# Altium project LaserSchematic.PrjPcb
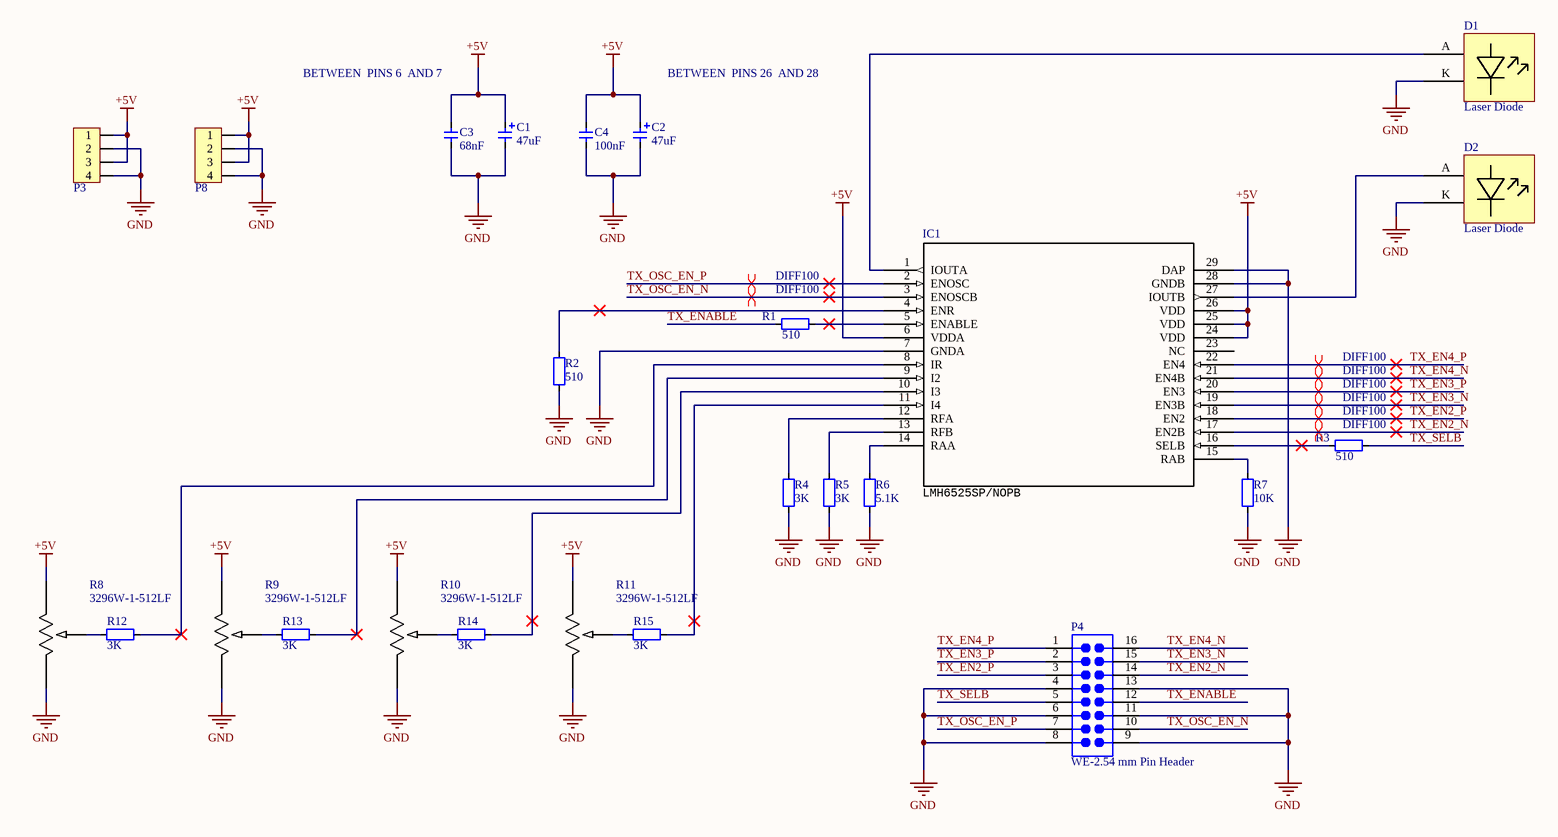
[diagram p0: TransmitterV1.SchDoc]
5 sheets, 290 parts. Net scope: global (net labels, ports and power ports of the same name join across sheets).
Board file: PCB.PcbDoc
Sheets:
  TransmitterV1.SchDoc
  PhotodiodeReceiverV1.SchDoc
  PowerSupply.SchDoc
  Main.SchDoc
  LVDSDriverReceiver.SchDoc

## Sheet TransmitterV1.SchDoc
size B

### Parts
C1  value 47uF  [CAP_TAN_B1210]  (hidden comment: Cap_Tan_1210)
C2  value 47uF  [CAP_TAN_B1210]  (hidden comment: Cap_Tan_1210)
C3  value 68nF  [CAP_0603]  (hidden comment: Cap_0603)
C4  value 100nF  [CAP_0603]  (hidden comment: Cap_0603)
D1  Laser Diode  [LaserDiode]
D2  Laser Diode  [LaserDiode]
IC1  Manufacturer_Part_Number: LMH6525SP/NOPB  [SPA28A]  (hidden comment: LMH6525SPNOPB)
P3  HDR1x4_2.54  [HDR1x4_2.54_180]  (value not drawn)
P4  WE-2.54 mm Pin Header  [61301621121]
P8  HDR1x4_2.54  [HDR1x4_2.54_180]  (value not drawn)
R1  value 510  [RES_0603]  (hidden comment: Res_0603)
R2  value 510  [RES_0603]  (hidden comment: Res_0603)
R3  value 510  [RES_0603]  (hidden comment: Res_0603)
R4  value 3K  [RES_0603]  (hidden comment: Res_0603)
R5  value 3K  [RES_0603]  (hidden comment: Res_0603)
R6  value 5.1K  [RES_0603]  (hidden comment: Res_0603)
R7  value 10K  [RES_0603]  (hidden comment: Res_0603)
R8  3296W-1-512LF  [POT_3296W]
R9  3296W-1-512LF  [POT_3296W]
R10  3296W-1-512LF  [POT_3296W]
R11  3296W-1-512LF  [POT_3296W]
R12  value 3K  [RES_0603]  (hidden comment: Res_0603)
R13  value 3K  [RES_0603]  (hidden comment: Res_0603)
R14  value 3K  [RES_0603]  (hidden comment: Res_0603)
R15  value 3K  [RES_0603]  (hidden comment: Res_0603)

### Nets
+5V: C1.1 C2.1 C3.2 C4.2 IC1.6(VDDA) IC1.24(VDD) IC1.25(VDD) IC1.26(VDD) P3.1 P3.3 P8.1 P8.3 R8.3 R9.3 R10.3 R11.3
GND: C1.2 C2.2 C3.1 C4.1 D1.K D2.K IC1.7(GNDA) IC1.28(GNDB) IC1.29(DAP) P3.2 P3.4 P4.4 P4.6 P4.8 P4.9 P4.11 P4.13 P8.2 P8.4 R2.1 R4.1 R5.1 R6.1 R7.1 R8.1 R9.1 R10.1 R11.1
TX_EN2_N: IC1.17(EN2B) P4.14
TX_EN2_P: IC1.18(EN2) P4.3
TX_EN3_N: IC1.19(EN3B) P4.15
TX_EN3_P: IC1.20(EN3) P4.2
TX_EN4_N: IC1.21(EN4B) P4.16
TX_EN4_P: IC1.22(EN4) P4.1
TX_ENABLE: P4.12 R1.1
TX_OSC_EN_N: IC1.3(ENOSCB) P4.10
TX_OSC_EN_P: IC1.2(ENOSC) P4.7
TX_SELB: P4.5 R3.2
NetD1_A: D1.A IC1.1(IOUTA)
NetD2_A: D2.A IC1.27(IOUTB)
NetIC1_4: IC1.4(ENR) R2.2
NetIC1_5: IC1.5(ENABLE) R1.2
NetIC1_8: IC1.8(IR) R12.2
NetIC1_9: IC1.9(I2) R13.2
NetIC1_10: IC1.10(I3) R14.2
NetIC1_11: IC1.11(I4) R15.2
NetIC1_12: IC1.12(RFA) R4.2
NetIC1_13: IC1.13(RFB) R5.2
NetIC1_14: IC1.14(RAA) R6.2
NetIC1_15: IC1.15(RAB) R7.2
NetIC1_16: IC1.16(SELB) R3.1
NetR8_2: R8.2 R12.1
NetR9_2: R9.2 R13.1
NetR10_2: R10.2 R14.1
NetR11_2: R11.2 R15.1

Not connected (* = marked no-connect by the designer): IC1 23(NC)

### Layout directives
differential pair; net class DIFF100: TX_EN2_N, TX_EN2_P, TX_EN3_N, TX_EN3_P, TX_EN4_N, TX_EN4_P, TX_OSC_EN_N, TX_OSC_EN_P

### Notes on the sheet
- (near C3) BETWEEN  PINS 6  AND 7
- BETWEEN  PINS 26  AND 28

### Library data of the parts
C1 C2 = Cap_Tan_1210: Capacitor
C3 C4 = Cap_0603: Capacitor
IC1 = LMH6525SPNOPB: Imported; Vendor: National Semiconductor; 3D_Library_Name: National_9-26-2011; C: Copyright (C) 2015 Accelerated Designs. All rights reserved; Copyright: Copyright (C) 2015 Accelerated Designs. All rights reserved; RefDes: RefDes; Type: DEV; Value: Value
P3 P8 = HDR1x4_2.54T: Header
P4 = WE-2.54 mm Pin Header & Jumper 61301621121: WR-PHD 2.54 mm Dual Pin Header; Manufacturer: WЁ№rth Elektronik eiSos GmbH; ComponentLink1 Description: Manufacturer; ComponentLink2 Description: Datasheet; NoPins: 16; Created Date: 25 March 2013; partNo: 61301621121; ComponentLink1URL: http://www.we-online.com; ComponentLink2URL: http://katalog.we-online.de/em/datasheet/6130xx21121.pdf; Created by: Karrer Zheng
R1-R7 R12-R15 = Res_0603: Resistor
R8-R11 = 3296W-1-503LF: Imported; Vendor: Bourns Electronics; HEADER_SECTION: Passives; HEADER_GROUP: Resistors; R-S_Number: 5219805; Tolerance: 10%; Voltage: Unknown; C: Copyright (C) 2015 Accelerated Designs. All rights reserved; Manufacturer_Part_Number: 3296W-1-503LF; Manufacturer_Name: Bourns Electronics; Mounting: Through Hole; Value: Value; Package/Case: Unknown; Current Rating: Unknown; Copyright: Copyright (C) 2015 Accelerated Designs. All rights reserved; RefDes: RefDes; Type: DEV

## Sheet PhotodiodeReceiverV1.SchDoc
size C; PageSetup: Record=PageOptions|CenterHorizontal=True|CenterVertical=True|PrintScale=1.06|XCorrection=1.00|YCorrection=1.00|PrintKind=1|BorderSize=5000000|LeftOffset=0|BottomOffset=0|Orientation=2|PaperLength=1000|PaperWidth=1000|Scale=100|PaperSource=7|PrintQuality=-3|MediaType=1|DitherType=10|PrintScaleMode=1|PaperKind=A3|PaperIndex=8
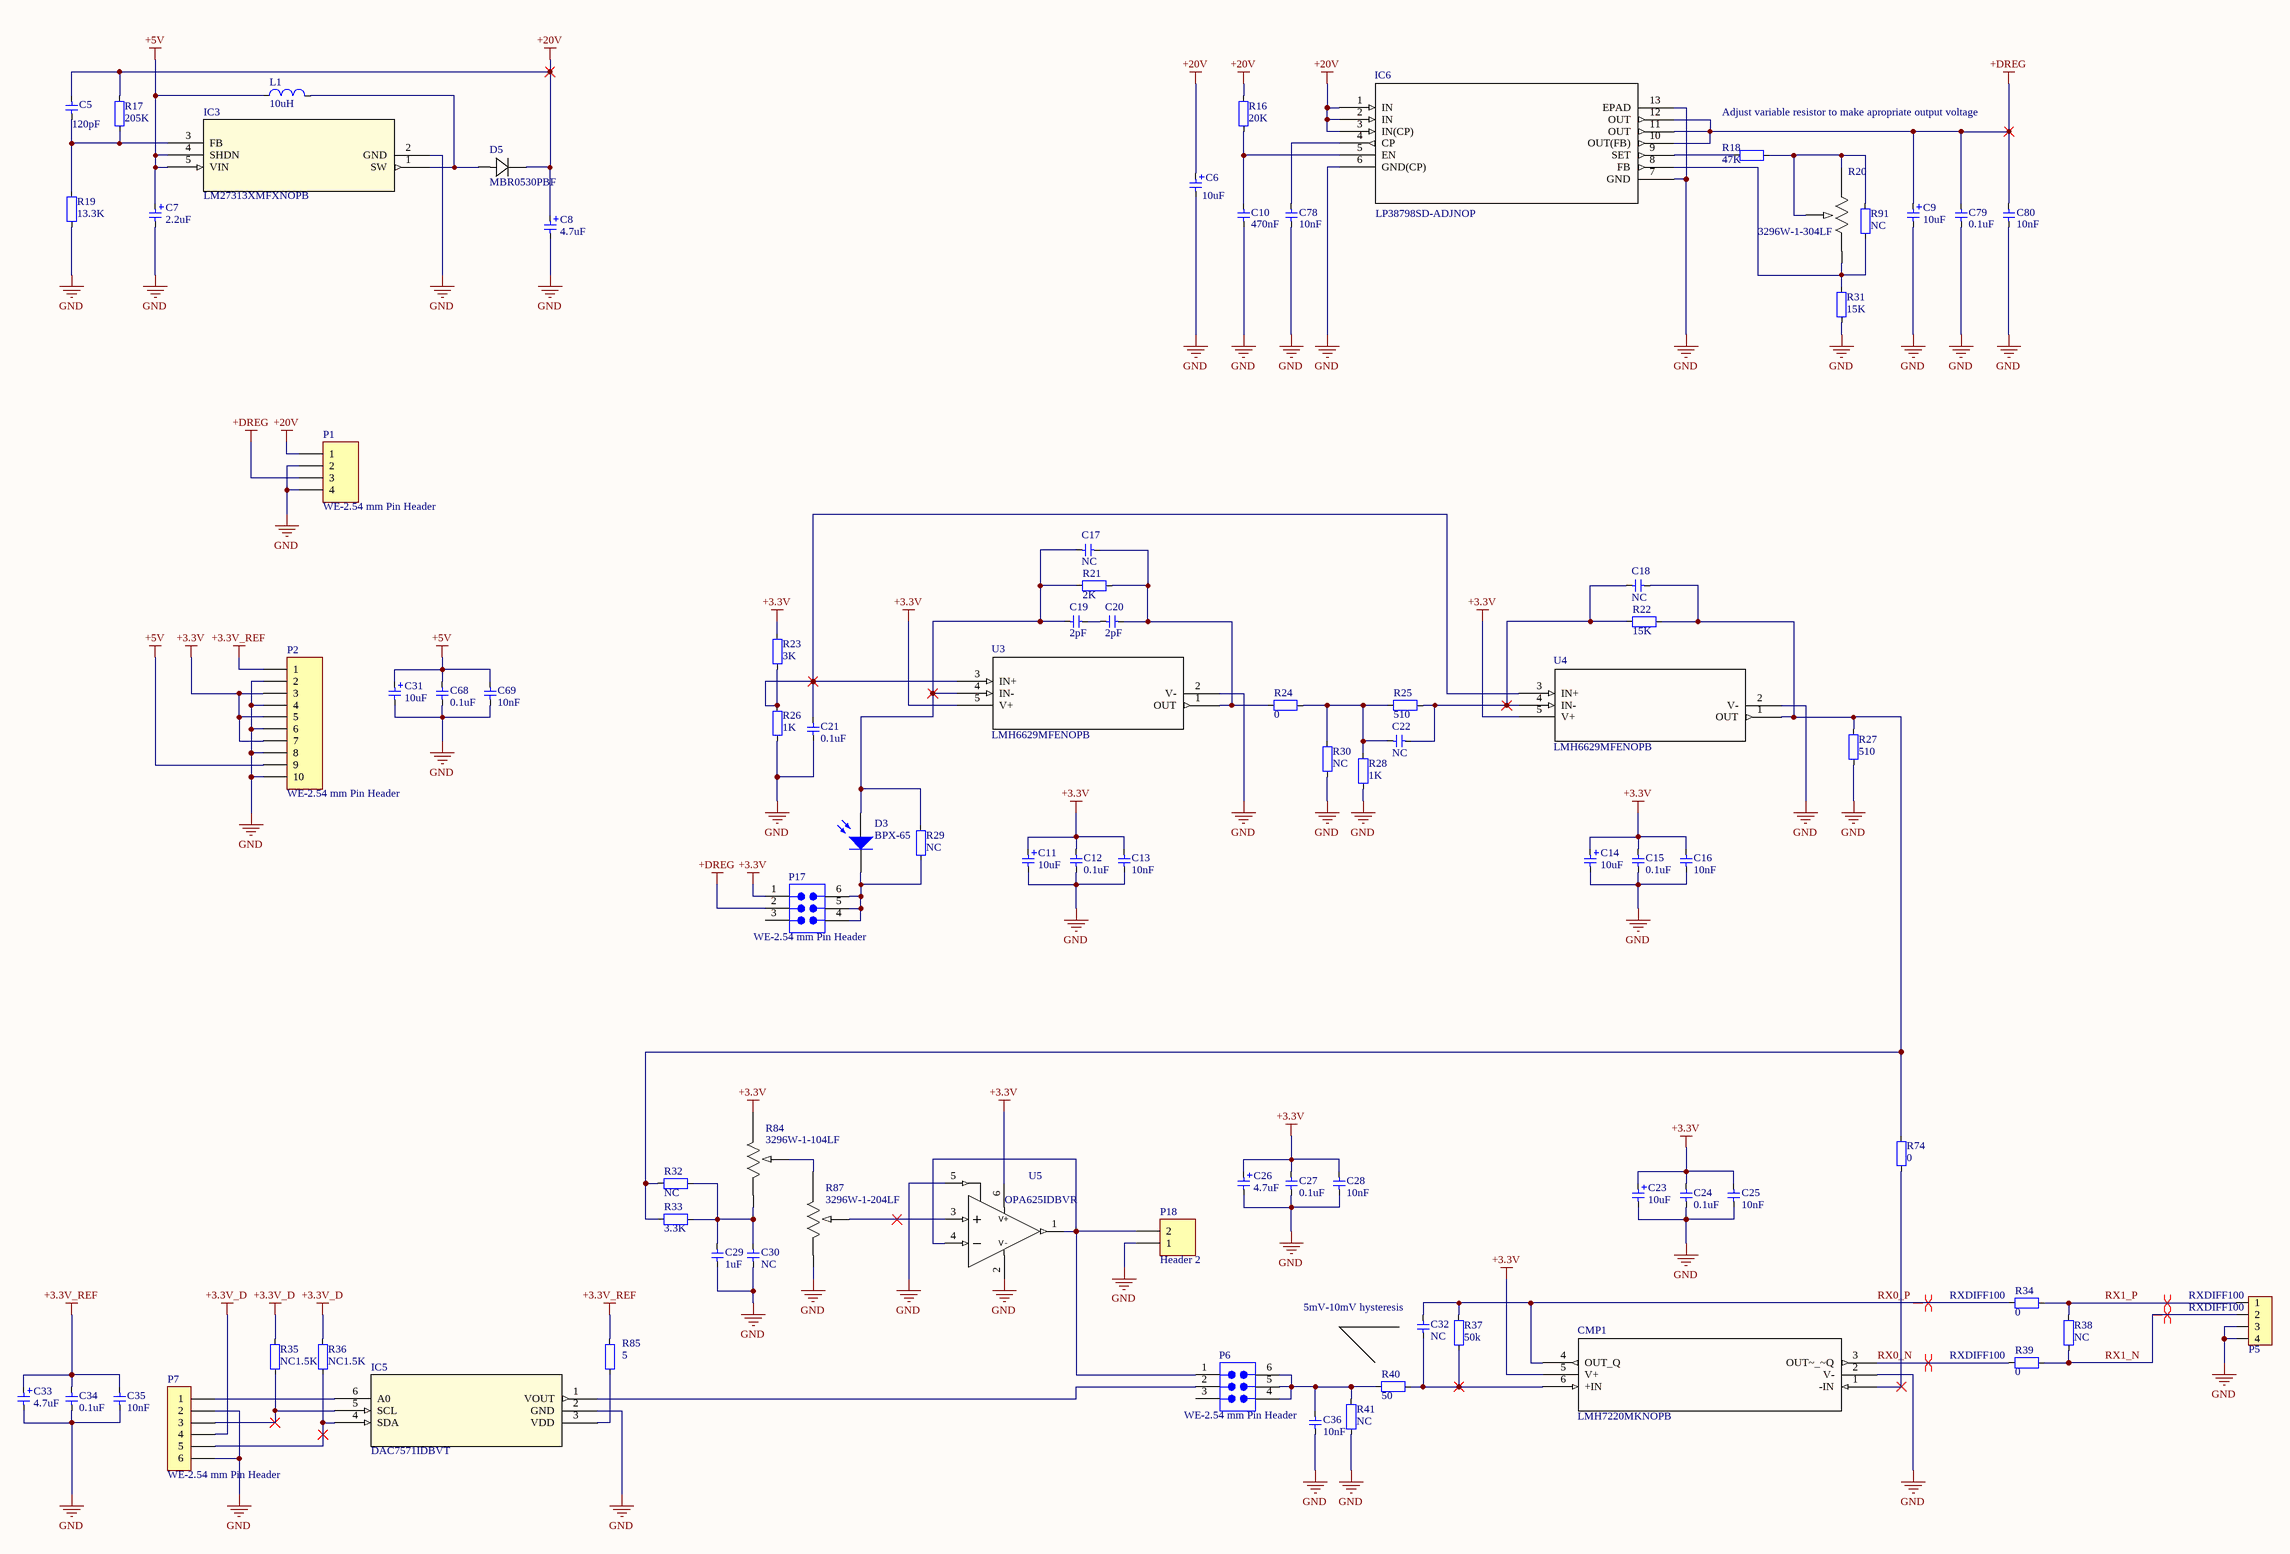
[diagram p1: PhotodiodeReceiverV1.SchDoc]

### Parts
C5  value 120pF  [CAP_0603]  (hidden comment: Cap_0603)
C6  value 10uF  [CAP_TAN_A1206]  (hidden comment: Cap_Tan_1206)
C7  value 2.2uF  [CAP_TAN_A1206]  (hidden comment: Cap_Tan_1206)
C8  value 4.7uF  [CAP_TAN_A1206]  (hidden comment: Cap_Tan_1206)
C9  value 10uF  [CAP_TAN_A1206]  (hidden comment: Cap_Tan_1206)
C10  value 470nF  [CAP_0805]  (hidden comment: Cap_0805)
C11  value 10uF  [CAP_TAN_A1206]  (hidden comment: Cap_Tan_1206)
C12  value 0.1uF  [CAP_0603]  (hidden comment: Cap_0603)
C13  value 10nF  [CAP_0603]  (hidden comment: Cap_0603)
C14  value 10uF  [CAP_TAN_A1206]  (hidden comment: Cap_Tan_1206)
C15  value 0.1uF  [CAP_0603]  (hidden comment: Cap_0603)
C16  value 10nF  [CAP_0603]  (hidden comment: Cap_0603)
C17  value NC  [CAP_0603]  (hidden comment: Cap_0603)
C18  value NC  [CAP_0603]  (hidden comment: Cap_0603)
C19  value 2pF  [CAP_0603]  (hidden comment: Cap_0603)
C20  value 2pF  [CAP_0603]  (hidden comment: Cap_0603)
C21  value 0.1uF  [CAP_0603]  (hidden comment: Cap_0603)
C22  value NC  [CAP_0603]  (hidden comment: Cap_0603)
C23  value 10uF  [CAP_TAN_A1206]  (hidden comment: Cap_Tan_1206)
C24  value 0.1uF  [CAP_0603]  (hidden comment: Cap_0603)
C25  value 10nF  [CAP_0603]  (hidden comment: Cap_0603)
C26  value 4.7uF  [CAP_TAN_A1206]  (hidden comment: Cap_Tan_1206)
C27  value 0.1uF  [CAP_0603]  (hidden comment: Cap_0603)
C28  value 10nF  [CAP_0603]  (hidden comment: Cap_0603)
C29  value 1uF  [CAP_0805]  (hidden comment: Cap_0805)
C30  value NC  [CAP_0805]  (hidden comment: Cap_0805)
C31  value 10uF  [CAP_TAN_A1206]  (hidden comment: Cap_Tan_1206)
C32  value NC  [CAP_0603]  (hidden comment: Cap_0603)
C33  value 4.7uF  [CAP_TAN_A1206]  (hidden comment: Cap_Tan_1206)
C34  value 0.1uF  [CAP_0603]  (hidden comment: Cap_0603)
C35  value 10nF  [CAP_0603]  (hidden comment: Cap_0603)
C36  value 10nF  [CAP_0603]  (hidden comment: Cap_0603)
C68  value 0.1uF  [CAP_0603]  (hidden comment: Cap_0603)
C69  value 10nF  [CAP_0603]  (hidden comment: Cap_0603)
C78  value 10nF  [CAP_0603]  (hidden comment: Cap_0603)
C79  value 0.1uF  [CAP_0603]  (hidden comment: Cap_0603)
C80  value 10nF  [CAP_0603]  (hidden comment: Cap_0603)
CMP1  LMH7220MKNOPB  [MK06A]
D3  BPX-65  [PIN2]
D5  MBR0530PBF  [DIODE_SOD123]
IC3  LM27313XMFXNOPB  [MF05A]
IC5  DAC7571IDBVT  [DBV6]
IC6  LP38798SD-ADJNOP  [DNT12]
L1  value 10uH  [IND_CD32]  (hidden comment: Ind_CD32)
P1  WE-2.54 mm Pin Header  [61000418221]
P2  WE-2.54 mm Pin Header  [61001018221]
P5  HDR1x4_2.54  [HDR1x4_2.54_180]  (value not drawn)
P6  WE-2.54 mm Pin Header  [610x0621121]
P7  WE-2.54 mm Pin Header  [61000618321]
P17  WE-2.54 mm Pin Header  [610x0621121]
P18  Header 2  [HDR1X2]
R16  value 20K  [RES_0603]  (hidden comment: Res_0603)
R17  value 205K  [RES_0805]  (hidden comment: Res_0805)
R18  value 47K  [RES_0603]  (hidden comment: Res_0603)
R19  value 13.3K  [RES_0603]  (hidden comment: Res_0603)
R20  3296W-1-304LF  [POT_3296W]
R21  value 2K  [RES_0603]  (hidden comment: Res_0603)
R22  value 15K  [RES_0603]  (hidden comment: Res_0603)
R23  value 3K  [RES_0603]  (hidden comment: Res_0603)
R24  value 0  [RES_0603]  (hidden comment: Res_0603)
R25  value 510  [RES_0603]  (hidden comment: Res_0603)
R26  value 1K  [RES_0603]  (hidden comment: Res_0603)
R27  value 510  [RES_0603]  (hidden comment: Res_0603)
R28  value 1K  [RES_0603]  (hidden comment: Res_0603)
R29  value NC  [RES_0603]  (hidden comment: Res_0603)
R30  value NC  [RES_0603]  (hidden comment: Res_0603)
R31  value 15K  [RES_0603]  (hidden comment: Res_0603)
R32  value NC  [RES_0805]  (hidden comment: Res_0805)
R33  value 3.3K  [RES_0805]  (hidden comment: Res_0805)
R34  value 0  [RES_0603]  (hidden comment: Res_0603)
R35  value NC1.5K  [RES_0603]  (hidden comment: Res_0603)
R36  value NC1.5K  [RES_0603]  (hidden comment: Res_0603)
R37  value 50k  [RES_0603]  (hidden comment: Res_0603)
R38  value NC  [RES_0603]  (hidden comment: Res_0603)
R39  value 0  [RES_0603]  (hidden comment: Res_0603)
R40  value 50  [RES_0603]  (hidden comment: Res_0603)
R41  value NC  [RES_0603]  (hidden comment: Res_0603)
R74  value 0  [RES_0603]  (hidden comment: Res_0603)
R84  3296W-1-104LF  [POT_3296W]
R85  value 5  [RES_0603]  (hidden comment: Res_0603)
R87  3296W-1-204LF  [POT_3296W]
R91  value NC  [RES_0603]  (hidden comment: Res_0603)
U3  LMH6629MFENOPB  [MF05A]
U4  LMH6629MFENOPB  [MF05A]
U5  OPA625IDBVR  [DBV0006A_N]

### Nets
+3.3V: C11.1 C12.2 C13.2 C14.1 C15.2 C16.2 C23.1 C24.2 C25.2 C26.1 C27.2 C28.2 CMP1.5(V+) P2.3 P2.5 P2.7 P17.1 R23.2 R84.3 U3.5(V+) U4.5(V+) U5.6(V+)
+3.3V_D: P7.4 R35.2 R36.2
+3.3V_REF: C33.1 C34.2 C35.2 P2.1 R85.2
+5V: C7.1 C31.1 C68.2 C69.2 IC3.4(SHDN) IC3.5(VIN) L1.1 P2.9
+20V: C5.2 C6.1 C8.1 D5.1 IC6.1(IN) IC6.2(IN) IC6.3(IN(CP)) P1.1 R16.1 R17.1
+DREG: C9.1 C79.2 C80.2 IC6.10(OUT(FB)) IC6.11(OUT) IC6.12(OUT) P1.3 P17.2
GND: C6.2 C7.2 C8.2 C9.2 C10.1 C11.2 C12.1 C13.1 C14.2 C15.1 C16.1 C21.1 C23.2 C24.1 C25.1 C26.2 C27.1 C28.1 C29.2 C30.2 C31.2 C33.2 C34.1 C35.1 C36.2 C68.1 C69.1 C78.1 C79.1 C80.1 CMP1.2(V-) IC3.2(GND) IC5.2(GND) IC6.6(GND(CP)) IC6.7(GND) IC6.13(EPAD) P1.2 P1.4 P2.2 P2.4 P2.6 P2.8 P2.10 P5.3 P5.4 P7.2 P7.6 P18.1 R19.1 R26.1 R27.2 R28.2 R30.2 R31.2 R41.1 R87.1 U3.2(V-) U4.2(V-) U5.2(V-) U5.5(MODE)
RX0_N: CMP1.3(OUT~_~Q) R39.2
RX0_P: C32.1 CMP1.4(OUT_Q) R34.1 R37.2
RX1_N: P5.2 R38.2 R39.1
RX1_P: P5.1 R34.2 R38.1
NetC5_1: C5.1 IC3.3(FB) R17.2 R19.2
NetC10_2: C10.2 IC6.5(EN) R16.2
NetC17_1: C17.1 C20.1 R21.1 R24.1 U3.1(OUT)
NetC17_2: C17.2 C19.2 D3.1(A) R21.2 R29.1 U3.4(IN-)
NetC18_1: C18.1 R22.1 R27.1 R32.2 R33.2 R74.2 U4.1(OUT)
NetC18_2: C18.2 C22.1 R22.2 R25.1 U4.4(IN-)
NetC19_1: C19.1 C20.2
NetC21_2: C21.2 R23.1 R26.2 U3.3(IN+) U4.3(IN+)
NetC22_2: C22.2 R24.2 R25.2 R28.1 R30.1
NetC29_1: C29.1 C30.1 R32.1 R33.1 R84.1
NetC32_2: C32.2 CMP1.6(+IN) R37.1 R40.2
NetC36_1: C36.1 P6.4 P6.5 P6.6 R40.1 R41.2
NetC78_2: C78.2 IC6.4(CP)
NetCMP1_1: CMP1.1(-IN) R74.1
NetD3_2: D3.2(K) P17.4 P17.5 P17.6 R29.2
NetD5_2: D5.2 IC3.1(SW) L1.2
NetIC5_1: IC5.1(VOUT) P6.2
NetIC5_3: IC5.3(VDD) R85.1
NetIC5_4: IC5.4(SDA) P7.5 R36.1
NetIC5_5: IC5.5(SCL) P7.3 R35.1
NetIC5_6: IC5.6(A0) P7.1
NetIC6_8: IC6.8(FB) R20.1 R31.1 R91.2
NetIC6_9: IC6.9(SET) R18.1
NetP6_1: P6.1 P18.2 U5.1(OUT) U5.4(IN-)
NetR18_2: R18.2 R20.2 R20.3 R91.1
NetR84_2: R84.2 R87.3
NetR87_2: R87.2 U5.3(IN+)

Not connected (* = marked no-connect by the designer): P6 3; P17 3

### Layout directives
differential pair; net class RXDIFF100: RX0_N, RX0_P, RX1_N, RX1_P

### Notes on the sheet
- (near R18) Adjust variable resistor to make apropriate output voltage
- (near C32) 5mV-10mV hysteresis

### Library data of the parts
C5 C12 C13 C15-C22 C24 C25 C27 C28 C32 C34-C36 C68 C69 C78-C80 = Cap_0603: Capacitor
C6-C9 C11 C14 C23 C26 C31 C33 = Cap_Tan_1206: Capacitor
C10 C29 C30 = Cap_0805: Capacitor
CMP1 = LMH7220MKNOPB: Imported; Manufacturer_Part_Number: LMH7220MK/NOPB; CompType: OpAmpIC; Vendor: National Semiconductor; Symbol: NameLMH7220MK; 3D_Library_Name: National_Amplifiers; C: Copyright (C) 2015 Accelerated Designs. All rights reserved; Type: DEV; Version: 1; base_pn: LMH7220; Copyright: Copyright (C) 2015 Accelerated Designs. All rights reserved; RefDes: RefDes; Value: Value
D3 = Photo Sen: Photosensitive Diode; Published: 24-Mar-1999; LatestRevisionDate: 17-Jul-2002; LatestRevisionNote: Re-released for DXP Platform.; PackageReference: PIN2; Publisher: Altium Limited
D5 = MBR0530PBF: Imported; Vendor: Vishay; Supersection: Semiconductors; Section: Discretes; Type: DEV; C: Copyright (C) 2015 Accelerated Designs. All rights reserved; Manufacturer_Part_Number: MBR0530PBF; Family: Rectifier; Manufacturer_Name: Vishay; RS Part Number: 7000868; Copyright: Copyright (C) 2015 Accelerated Designs. All rights reserved; RefDes: RefDes; Value: Value
IC3 = LM27313XMFXNOPB: Imported; Part: No; Manufacturer_Part_Number: LM27313XMFX/NOPB; CompType: Switcher; Vendor: National Semiconductor; Vendor2: NationalSemiconductor; Version2: 1; Symbol: NameLM27313XMF; 3D_Library_Name: National_Switchers; C: Copyright (C) 2015 Accelerated Designs. All rights reserved; Type: DEV; Version: 05/02/2007; CompType2: Switcher; base_pn: LM27313; Copyright: Copyright (C) 2015 Accelerated Designs. All rights reserved; RefDes: RefDes; Value: Value
IC5 = DAC7571IDBVT: Imported; Vendor: Texas Instruments; Section: Data Converters; C: Copyright (C) 2015 Accelerated Designs. All rights reserved; Manufacturer_Part_Number: DAC7571IDBVT; Family: DAC; Manufacturer_Name: Texas Instruments; RS Part Number: 4615971; Copyright: Copyright (C) 2015 Accelerated Designs. All rights reserved; RefDes: RefDes; Type: DEV; Value: Value
IC6 = LP38798SD-ADJNOP: Imported; Manufacturer_Part_Number: lp38798sd-adj/nopb; Vendor: TEXAS INSTRUMENTS; C: Copyright (C) 2015 Accelerated Designs. All rights reserved; Copyright: Copyright (C) 2015 Accelerated Designs. All rights reserved; RefDes: RefDes; Type: DEV; Value: Value
L1 = Ind_CD32: Inductor
P1 = WE-2.54 mm Pin Header & Jumper 61000418221: WR-PHD 2.54 mm SMT Pin Header; Manufacturer: WЁ№rth Elektronik eiSos GmbH; ComponentLink1 Description: Manufacturer; ComponentLink2 Description: Datasheet; NoPins: 04; Created Date: 26 March 2013; partNo: 61000418221; ComponentLink1URL: http://www.we-online.com; ComponentLink2URL: http://katalog.we-online.de/em/datasheet/6100xx18221.pdf; Created by: Karrer Zheng
P2 = WE-2.54 mm Pin Header & Jumper 61001018221: WR-PHD 2.54 mm SMT Pin Header; Manufacturer: WЁ№rth Elektronik eiSos GmbH; ComponentLink1 Description: Manufacturer; ComponentLink2 Description: Datasheet; NoPins: 10; Created Date: 26 March 2013; partNo: 61001018221; ComponentLink1URL: http://www.we-online.com; ComponentLink2URL: http://katalog.we-online.de/em/datasheet/6100xx18221.pdf; Created by: Karrer Zheng
P5 = HDR1x4_2.54: Header
P6 P17 = WE-2.54 mm Pin Header & Jumper 610x0621121: WR-PHD 2.54 mm Dual SMT Pin Header; Manufacturer: WЁ№rth Elektronik eiSos GmbH; ComponentLink1 Description: Manufacturer; ComponentLink2 Description: Datasheet; NoPins: 06; Created Date: 22 March 2013; partNo: 610x0621121; ComponentLink1URL: http://www.we-online.com; ComponentLink2URL: http://katalog.we-online.de/em/datasheet/6100xx21121.pdf; Created by: Karrer Zheng
P7 = WE-2.54 mm Pin Header & Jumper 61000618321: WR-PHD 2.54 mm SMT Pin Header; Manufacturer: WЁ№rth Elektronik eiSos GmbH; ComponentLink1 Description: Manufacturer; ComponentLink2 Description: Datasheet; NoPins: 06; Created Date: 26 March 2013; partNo: 61000618321; ComponentLink1URL: http://www.we-online.com; ComponentLink2URL: http://katalog.we-online.de/em/datasheet/6100xx18221.pdf; Created by: Karrer Zheng
P18 = Header 2: Header, 2-Pin; LatestRevisionDate: 17-Jul-2002; LatestRevisionNote: Re-released for DXP Platform.; Publisher: Altium Limited
R16 R18 R19 R21-R31 R34-R41 R74 R85 R91 = Res_0603: Resistor
R17 R32 R33 = Res_0805: Resistor
R20 R84 R87 = 3296W-1-503LF: as R8 on sheet TransmitterV1; Manufacturer_Part_Number: 3296W-1-503LF; Manufacturer_Name: Bourns Electronics; Mounting: Through Hole; Value: Value; Package/Case: Unknown; Current Rating: Unknown; Copyright: Copyright (C) 2015 Accelerated Designs. All rights reserved; RefDes: RefDes; Type: DEV
U3 U4 = LMH6629MFENOPB: Imported; Manufacturer: Texas Instruments; Manufacturer_Part_Number: lmh6629_dbv_5; Vendor: National Semiconductor; C: Copyright (C) 2015 Accelerated Designs. All rights reserved; DatasheetURL: http://www.ti.com/lit/ds/symlink/lmh6629.pdf; basePN: LMH6629; NSC_PackageReference: MF05A; Copyright: Copyright (C) 2015 Accelerated Designs. All rights reserved; RefDes: RefDes; Type: DEV; Value: Value
U5 = OPA625IDBVR: Imported; Alternate PartNumber: OPA625IDBVT; Manufacturer: Texas Instruments; CompType: IC; PIN_COUNT: 6; PartNumber: OPA625IDBVR; PackageReference: DBV0006A; MountType: SMT; RoHS: Y; RefDes: RefDes; Type: DEV; Value: Value

## Sheet PowerSupply.SchDoc
size A3
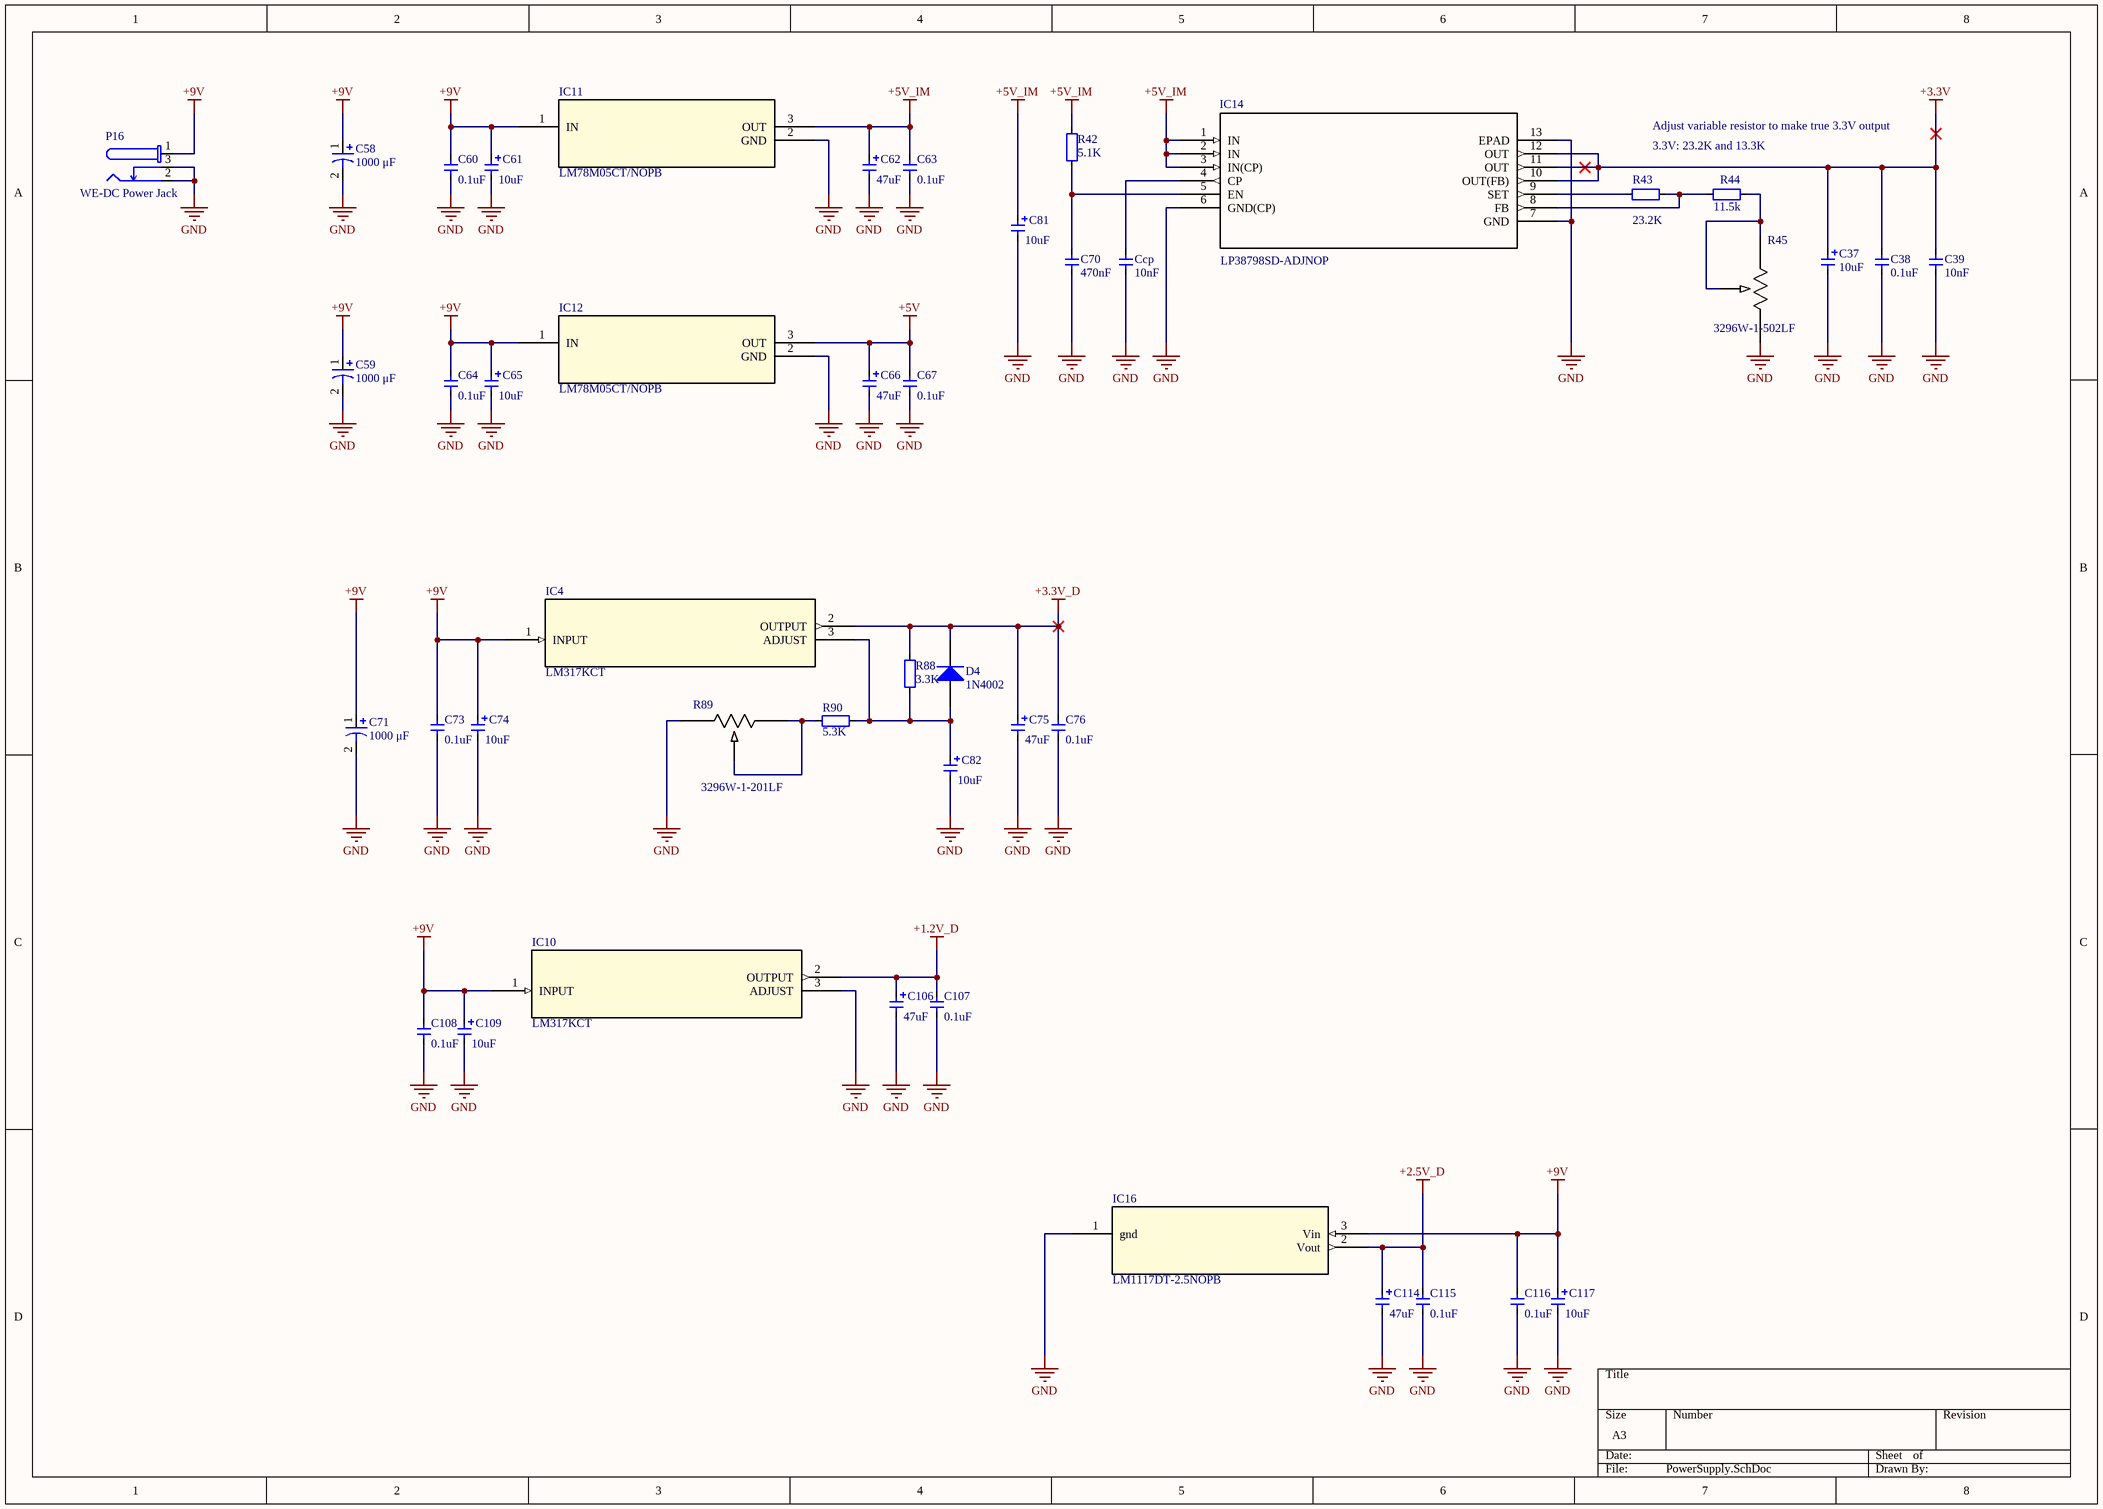
[diagram p2: PowerSupply.SchDoc]

### Parts
C37  value 10uF  [CAP_TAN_A1206]  (hidden comment: Cap_Tan_1206)
C38  value 0.1uF  [CAP_0603]  (hidden comment: Cap_0603)
C39  value 10nF  [CAP_0603]  (hidden comment: Cap_0603)
C58  1000 μF  [WCAP-ATUL 5x11x2x0.5]
C59  1000 μF  [WCAP-ATUL 5x11x2x0.5]
C60  value 0.1uF  [CAP_0603]  (hidden comment: Cap_0603)
C61  value 10uF  [CAP_TAN_A1206]  (hidden comment: Cap_Tan_1206)
C62  value 47uF  [CAP_TAN_A1206]  (hidden comment: Cap_Tan_1206)
C63  value 0.1uF  [CAP_0603]  (hidden comment: Cap_0603)
C64  value 0.1uF  [CAP_0603]  (hidden comment: Cap_0603)
C65  value 10uF  [CAP_TAN_A1206]  (hidden comment: Cap_Tan_1206)
C66  value 47uF  [CAP_TAN_A1206]  (hidden comment: Cap_Tan_1206)
C67  value 0.1uF  [CAP_0603]  (hidden comment: Cap_0603)
C70  value 470nF  [CAP_0603]  (hidden comment: Cap_0603)
C71  1000 μF  [WCAP-ATUL 5x11x2x0.5]
C73  value 0.1uF  [CAP_0603]  (hidden comment: Cap_0603)
C74  value 10uF  [CAP_TAN_A1206]  (hidden comment: Cap_Tan_1206)
C75  value 47uF  [CAP_TAN_A1206]  (hidden comment: Cap_Tan_1206)
C76  value 0.1uF  [CAP_0603]  (hidden comment: Cap_0603)
C81  value 10uF  [CAP_TAN_A1206]  (hidden comment: Cap_Tan_1206)
C82  value 10uF  [CAP_TAN_A1206]  (hidden comment: Cap_Tan_1206)
C106  value 47uF  [CAP_TAN_A1206]  (hidden comment: Cap_Tan_1206)
C107  value 0.1uF  [CAP_0603]  (hidden comment: Cap_0603)
C108  value 0.1uF  [CAP_0603]  (hidden comment: Cap_0603)
C109  value 10uF  [CAP_TAN_A1206]  (hidden comment: Cap_Tan_1206)
C114  value 47uF  [CAP_TAN_A1206]  (hidden comment: Cap_Tan_1206)
C115  value 0.1uF  [CAP_0603]  (hidden comment: Cap_0603)
C116  value 0.1uF  [CAP_0603]  (hidden comment: Cap_0603)
C117  value 10uF  [CAP_TAN_A1206]  (hidden comment: Cap_Tan_1206)
Ccp  value 10nF  [CAP_0603]  (hidden comment: Cap_0603)
D4  1N4002  [DO-41]
IC4  LM317KCT  [KC3]
IC10  LM317KCT  [KC3]
IC11  LM78M05CT/NOPB  [T03B]
IC12  LM78M05CT/NOPB  [T03B]
IC14  LP38798SD-ADJNOP  [DNT12]
IC16  LM1117DT-2.5NOPB  [TD03B]
P16  WE-DC Power Jack  [694106106102]
R42  value 5.1K  [RES_0603]  (hidden comment: Res_0603)
R43  value 23.2K  [RES_0603]  (hidden comment: Res_0603)
R44  value 11.5k  [RES_0603]  (hidden comment: Res_0603)
R45  3296W-1-502LF  [POT_3296W]
R88  value 3.3K  [RES_0603]  (hidden comment: Res_0603)
R89  3296W-1-201LF  [POT_3296W]
R90  value 5.3K  [RES_0603]  (hidden comment: Res_0603)

### Nets
+1.2V_D: C106.1 C107.2 IC10.2(OUTPUT)
+2.5V_D: C114.1 C115.2 IC16.2(Vout)
+3.3V: C37.1 C38.2 C39.2 IC14.10(OUT(FB)) IC14.11(OUT) IC14.12(OUT)
+3.3V_D: C75.1 C76.2 D4.2(K) IC4.2(OUTPUT) R88.2
+5V: C66.1 C67.2 IC12.3(OUT)
+5V_IM: C62.1 C63.2 C81.1 IC11.3(OUT) IC14.1(IN) IC14.2(IN) IC14.3(IN(CP)) R42.1
+9V: C58.1 C59.1 C60.2 C61.1 C64.2 C65.1 C71.1 C73.2 C74.1 C108.2 C109.1 C116.2 C117.1 IC4.1(INPUT) IC10.1(INPUT) IC11.1(IN) IC12.1(IN) IC16.3(Vin) P16.1
GND: C37.2 C38.1 C39.1 C58.2 C59.2 C60.1 C61.2 C62.2 C63.1 C64.1 C65.2 C66.2 C67.1 C70.1 C71.2 C73.1 C74.2 C75.2 C76.1 C81.2 C82.2 C106.2 C107.1 C108.1 C109.2 C114.2 C115.1 C116.1 C117.2 Ccp.1 IC10.3(ADJUST) IC11.2(GND) IC12.2(GND) IC14.6(GND(CP)) IC14.7(GND) IC14.13(EPAD) IC16.1(gnd) P16.2 P16.3 R45.1 R89.3
NetC70_2: C70.2 IC14.5(EN) R42.2
NetC82_1: C82.1 D4.1(A) IC4.3(ADJUST) R88.1 R90.2
NetCcp_2: Ccp.2 IC14.4(CP)
NetIC14_8: IC14.8(FB) R43.2 R44.2
NetIC14_9: IC14.9(SET) R43.1
NetR44_1: R44.1 R45.2 R45.3
NetR89_1: R89.1 R89.2 R90.1

### Notes on the sheet
- Adjust variable resistor to make true 3.3V output
- 3.3V: 23.2K and 13.3K

### Library data of the parts
C37 C61 C62 C65 C66 C74 C75 C81 C82 C106 C109 C114 C117 = Cap_Tan_1206: Capacitor
C38 C39 C60 C63 C64 C67 C70 C73 C76 C107 C108 C115 C116 Ccp = Cap_0603: Capacitor
C58 C59 C71 = WCAP-ATUL 5x11x2x0.5 860040272001: WCAP-ATUL Aluminum Electrolytic Capacitors , 100 μF; + / - 20%; 10 V , 5 x 11; Manufacturer: Wurth Elektronik; E-mail: libraries@we-online.com; Characteristics: Aluminum Electrolytic Capacitor;Recommended soldering: Wave;Operating temperature: –40 °C to +105 °C;Minimized ESR and long life product series;Load life: 4000–10000 h @ +105 °C; ComponentLink1Description: Manufacturer; ComponentLink1URL: http://www.we-online.com; ComponentLink2Description: Datasheet; ComponentLink2URL: http://katalog.we-online.de/pbs/datasheet/860040272001.pdf; Created by: Karrer Zheng; Created Date: 5/13/2015; Capacitance: 1000 μF; Application: Applied to high frequency secondary side output filter loop, general switching power supply, DC-DC converter, AC-DC converter, adapter, charger, TV, VCR, DC motor circuit filter, LCD TV digital audio, digital TV, digital camera, digital video camera, satellite receiver and etc.; partNo: 860040272001
D4 = Diode 1N4002: 1 Amp General Purpose Rectifier; Published: 8-Jun-2000; LatestRevisionDate: 17-Jul-2002; LatestRevisionNote: Re-released for DXP Platform.; DatasheetVersion: 1998; PackageVersion: Aug-1999; PackageReference: DO-41; Publisher: Altium Limited; PackageDescription: Diode, Axial; Body 5.2 x 2.7 mm (LxDia. max), Lead Dia. 0.86 mm (max); Code_JEDEC: DO-204-AL; ComponentLink1Description: Manufacturer Link; ComponentLink1URL: http://www.fairchildsemi.com/; ComponentLink2Description: Datasheet; ComponentLink2URL: http://www.fairchildsemi.com/ds/1N%2F1N4001.pdf
IC4 IC10 = LM317KCT: Imported; Manufacturer: Texas Instruments; GENERIC_PART_NUMBER: LM317; INDUSTRY_STD_PKG_TYPE: TO-220; FAMILY_NAME: STANDARD VOLTAGE REGULATOR; PIN_COUNT: 3; PACKAGE_DESIGNATOR: KC; 3D_Library_Name: TI_AllParts_2012-12-25; C: Copyright (C) 2015 Accelerated Designs. All rights reserved; Datasheet URL: http://www.ti.com/lit/gpn/LM317; Vendor: Texas Instruments; Manufacturer_Part_Number: LM317KCT; Copyright: Copyright (C) 2015 Accelerated Designs. All rights reserved; RefDes: RefDes; Type: DEV; Value: Value
IC11 IC12 = LM78M05CT/NOPB: Imported; Vendor: National Semiconductor; C: Copyright (C) 2015 Accelerated Designs. All rights reserved; Manufacturer_Part_Number: lm78m05ct; Copyright: Copyright (C) 2015 Accelerated Designs. All rights reserved; RefDes: RefDes; Type: DEV; Value: Value
IC14 = LP38798SD-ADJNOP: as IC6 on sheet PhotodiodeReceiverV1; Copyright: Copyright (C) 2015 Accelerated Designs. All rights reserved; RefDes: RefDes; Type: DEV; Value: Value
IC16 = LM1117DT-1_8NOPB: Imported; Manufacturer_Part_Number: LM1117DT-18; Vendor: National Semiconductor; C: Copyright (C) 2015 Accelerated Designs. All rights reserved; Copyright: Copyright (C) 2015 Accelerated Designs. All rights reserved; RefDes: RefDes; Type: DEV; Value: Value
P16 = WE-DC Power Jack 694106106102: WR-DC_DC Power Jack_Right Angled_SMT; Manufacturer: WЁ№rth Elektronik eiSos GmbH; ComponentLink1 Description: Manufacturer; ComponentLink2 Description: Datasheet; NoPins: 4; ComponentLink1URL: http://www.we-online.de; ComponentLink2URL: http://katalog.we-online.de/em/datasheet/6941xx106102.pdf; Created by: Karrer Zheng; Created Date: 10/17/2014; partNo: 694106106102
R42-R44 R88 R90 = Res_0603: Resistor
R45 R89 = 3296W-1-503LF: as R8 on sheet TransmitterV1; Manufacturer_Part_Number: 3296W-1-503LF; Manufacturer_Name: Bourns Electronics; Mounting: Through Hole; Value: Value; Package/Case: Unknown; Current Rating: Unknown; Copyright: Copyright (C) 2015 Accelerated Designs. All rights reserved; RefDes: RefDes; Type: DEV

## Sheet Main.SchDoc
size A1
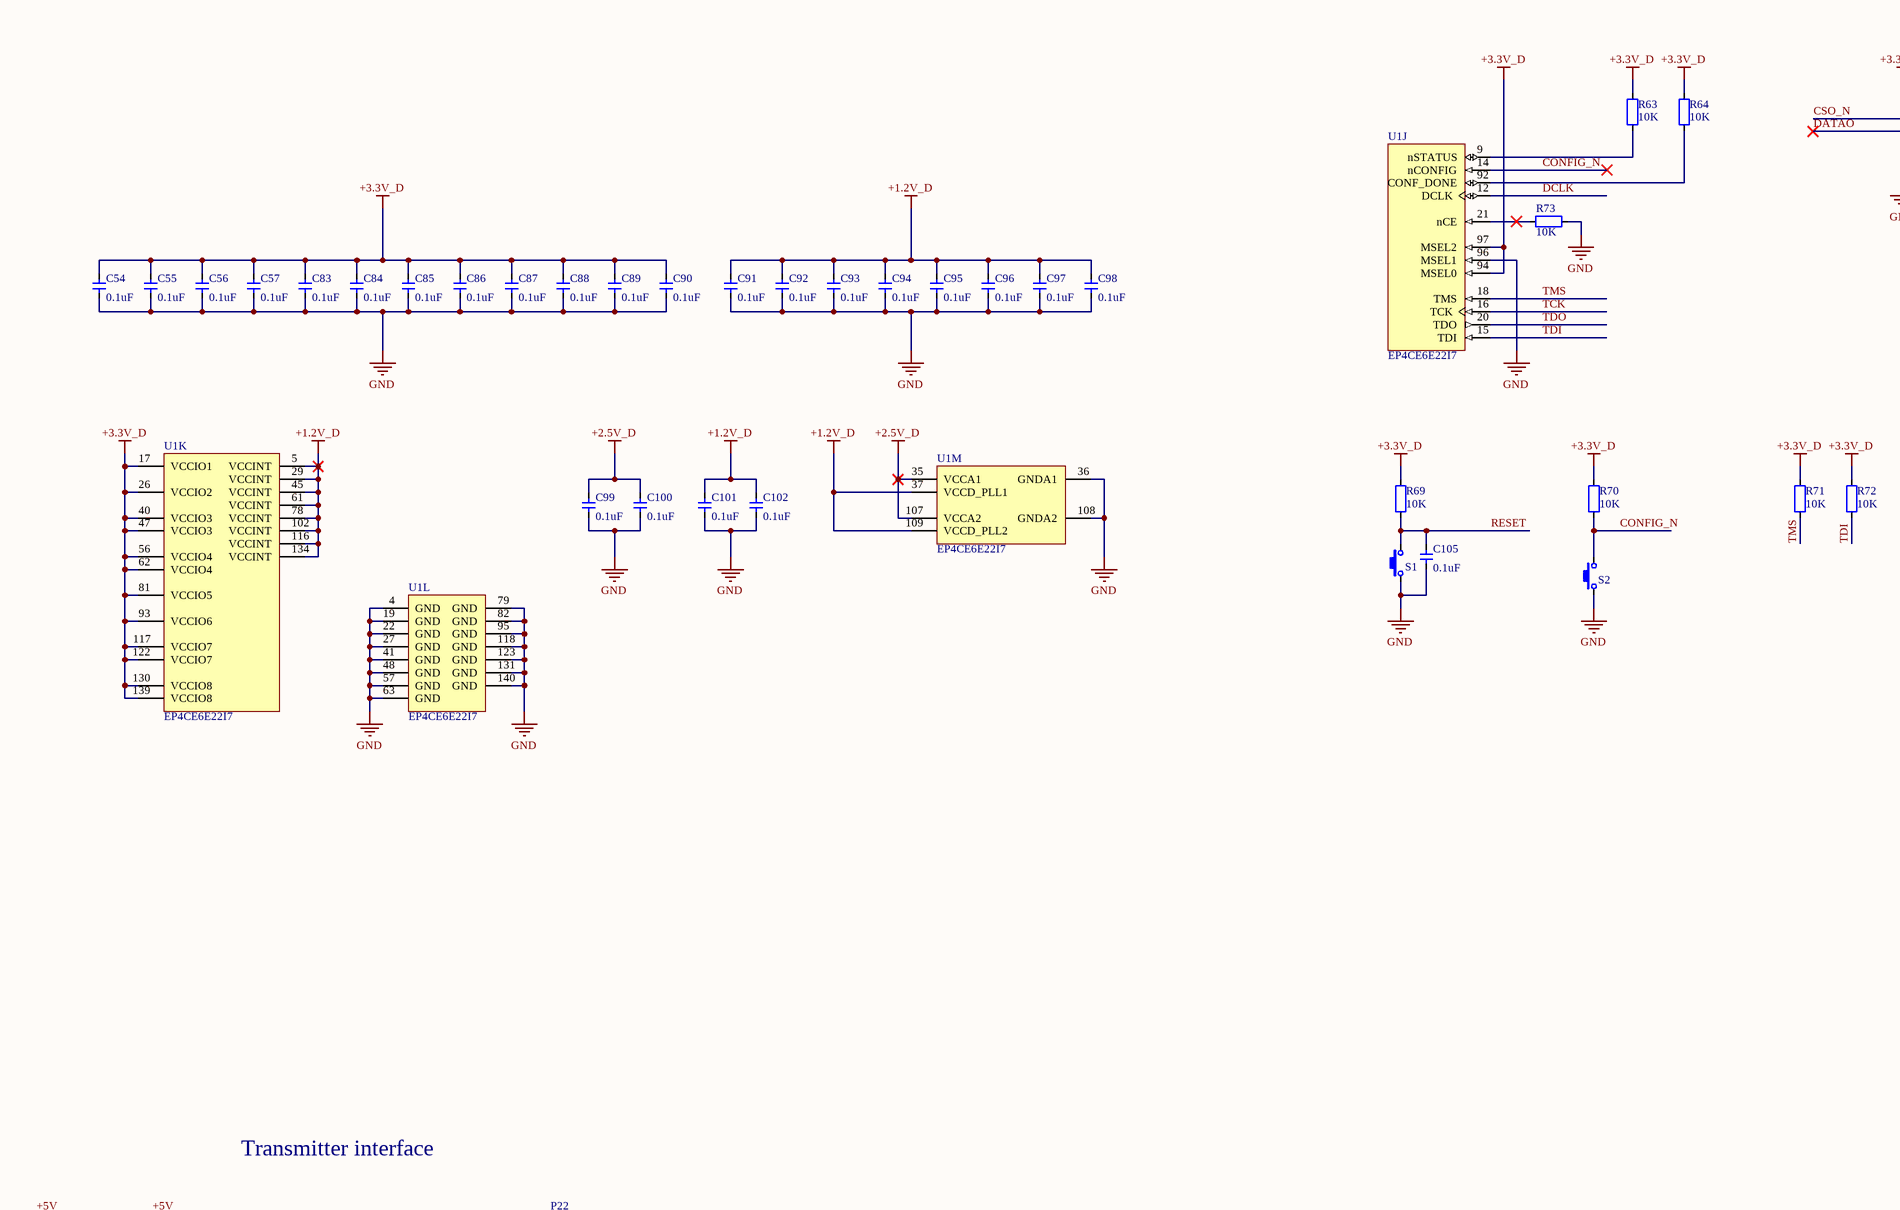
[diagram p3: Main.SchDoc, top left]
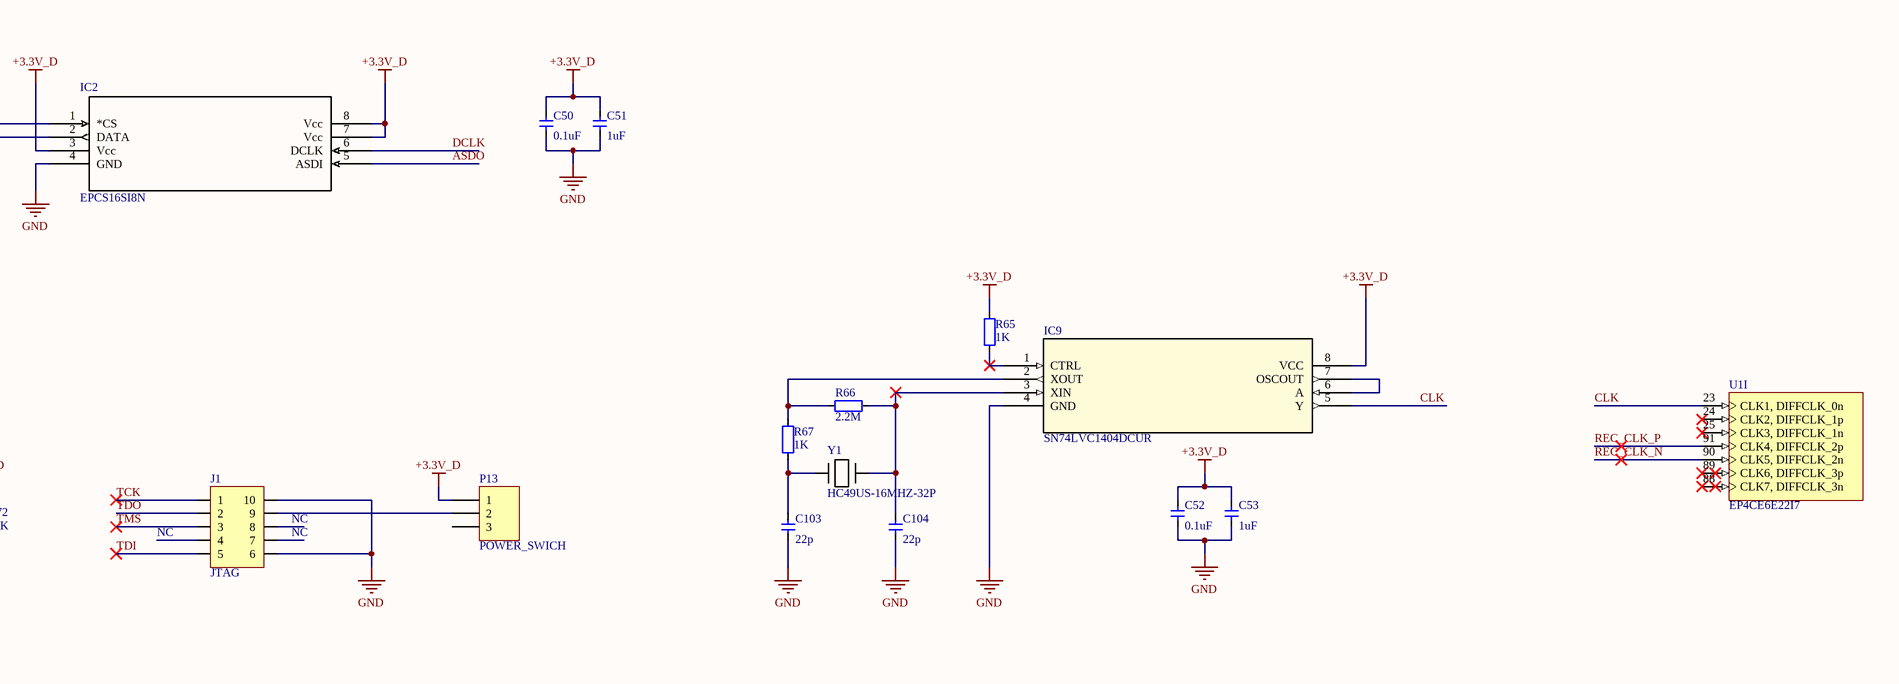
[diagram p4: Main.SchDoc, top right]
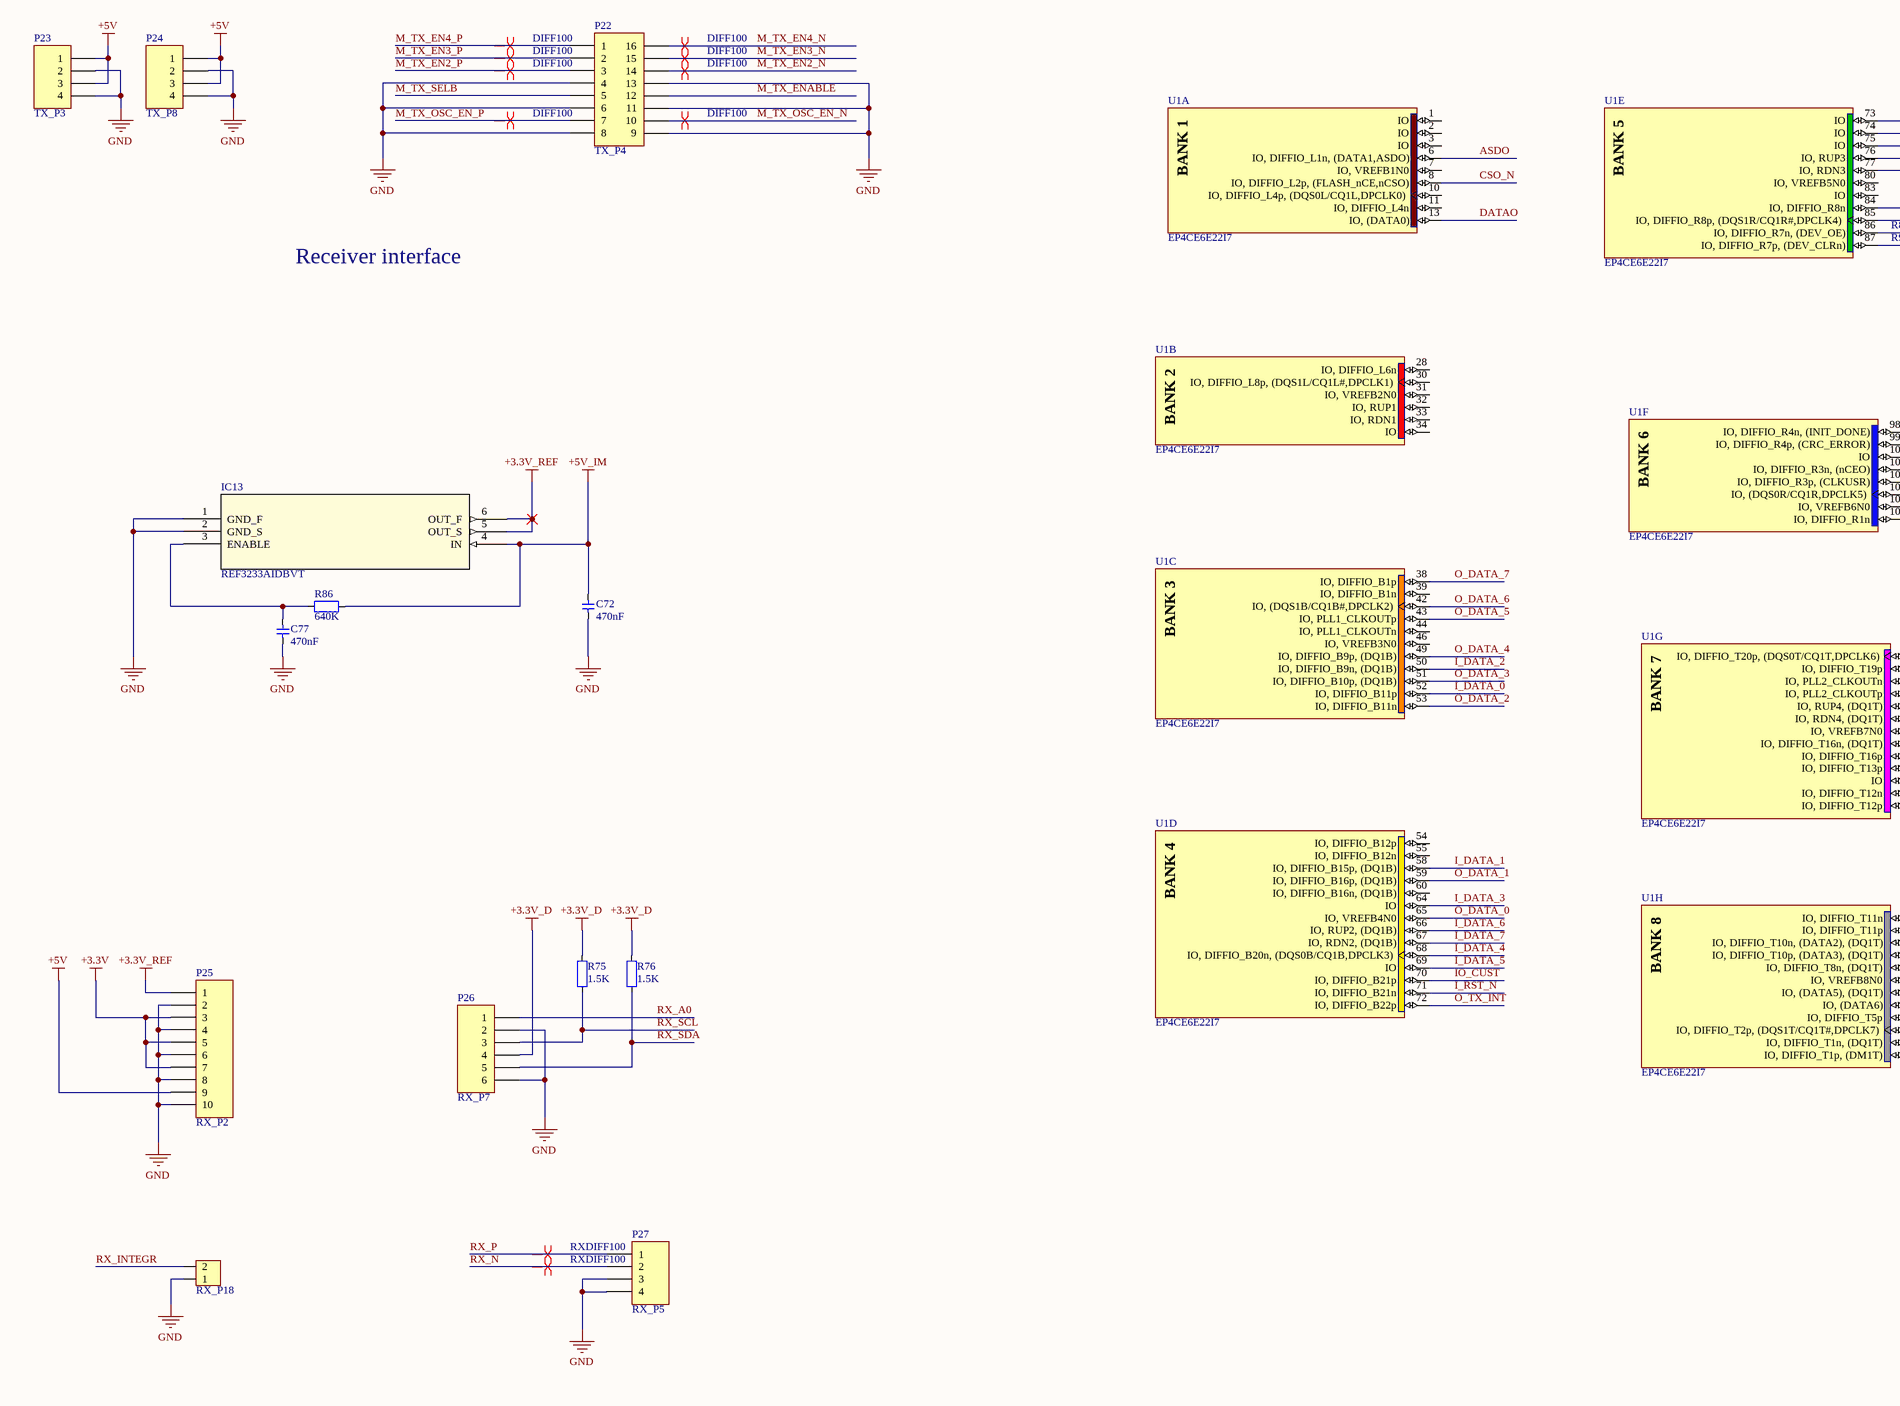
[diagram p5: Main.SchDoc, bottom left]
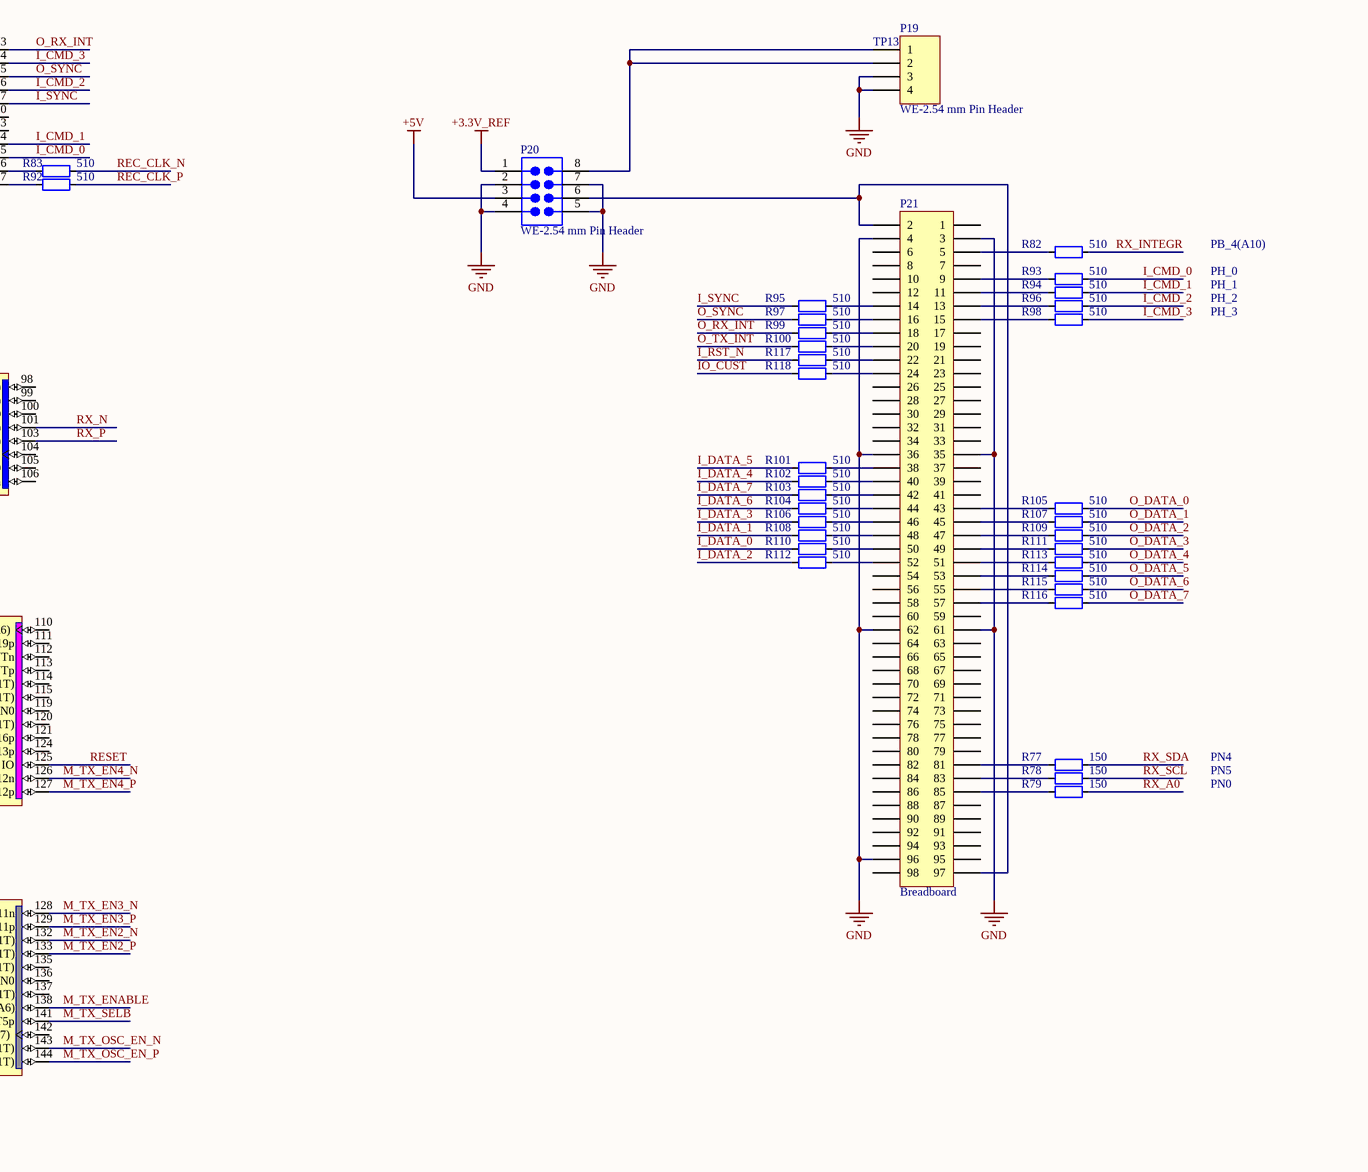
[diagram p6: Main.SchDoc, bottom right]

### Parts
C50  value 0.1uF  [CAP_0603]  (hidden comment: Cap_0603)
C51  value 1uF  [CAP_0603]  (hidden comment: Cap_0603)
C52  value 0.1uF  [CAP_0603]  (hidden comment: Cap_0603)
C53  value 1uF  [CAP_0603]  (hidden comment: Cap_0603)
C54  value 0.1uF  [CAP_0603]  (hidden comment: Cap_0603)
C55  value 0.1uF  [CAP_0603]  (hidden comment: Cap_0603)
C56  value 0.1uF  [CAP_0603]  (hidden comment: Cap_0603)
C57  value 0.1uF  [CAP_0603]  (hidden comment: Cap_0603)
C72  value 470nF  [CAP_0603]  (hidden comment: Cap_0603)
C77  value 470nF  [CAP_0603]  (hidden comment: Cap_0603)
C83  value 0.1uF  [CAP_0603]  (hidden comment: Cap_0603)
C84  value 0.1uF  [CAP_0603]  (hidden comment: Cap_0603)
C85  value 0.1uF  [CAP_0603]  (hidden comment: Cap_0603)
C86  value 0.1uF  [CAP_0603]  (hidden comment: Cap_0603)
C87  value 0.1uF  [CAP_0603]  (hidden comment: Cap_0603)
C88  value 0.1uF  [CAP_0603]  (hidden comment: Cap_0603)
C89  value 0.1uF  [CAP_0603]  (hidden comment: Cap_0603)
C90  value 0.1uF  [CAP_0603]  (hidden comment: Cap_0603)
C91  value 0.1uF  [CAP_0603]  (hidden comment: Cap_0603)
C92  value 0.1uF  [CAP_0603]  (hidden comment: Cap_0603)
C93  value 0.1uF  [CAP_0603]  (hidden comment: Cap_0603)
C94  value 0.1uF  [CAP_0603]  (hidden comment: Cap_0603)
C95  value 0.1uF  [CAP_0603]  (hidden comment: Cap_0603)
C96  value 0.1uF  [CAP_0603]  (hidden comment: Cap_0603)
C97  value 0.1uF  [CAP_0603]  (hidden comment: Cap_0603)
C98  value 0.1uF  [CAP_0603]  (hidden comment: Cap_0603)
C99  value 0.1uF  [CAP_0603]  (hidden comment: Cap_0603)
C100  value 0.1uF  [CAP_0603]  (hidden comment: Cap_0603)
C101  value 0.1uF  [CAP_0603]  (hidden comment: Cap_0603)
C102  value 0.1uF  [CAP_0603]  (hidden comment: Cap_0603)
C103  value 22p  [CAP_0603]  (hidden comment: Cap_0603)
C104  value 22p  [CAP_0603]  (hidden comment: Cap_0603)
C105  value 0.1uF  [CAP_0603]  (hidden comment: Cap_0603)
IC2  EPCS16SI8N  [8-SOIC]
IC9  SN74LVC1404DCUR  [DCU8]
IC13  REF3233AIDBVT  [DBV6]
J1  JTAG  [66101021622]
P13  POWER_SWICH  [61300311121]
P19  WE-2.54 mm Pin Header  [61000418221]
P20  WE-2.54 mm Pin Header  [610x0821121]
P21  Breadboard  [Breadboard]
P22  TX_P4  [61001621821]
P23  TX_P3  [61000411921]
P24  TX_P8  [61000411921]
P25  RX_P2  [61301011821]
P26  RX_P7  [61000613321]
P27  RX_P5  [61000413321]
R63  value 10K  [RES_0603]  (hidden comment: Res_0603)
R64  value 10K  [RES_0603]  (hidden comment: Res_0603)
R65  value 1K  [RES_0603]  (hidden comment: Res_0603)
R66  value 2.2M  [RES_0603]  (hidden comment: Res_0603)
R67  value 1K  [RES_0603]  (hidden comment: Res_0603)
R69  value 10K  [RES_0603]  (hidden comment: Res_0603)
R70  value 10K  [RES_0603]  (hidden comment: Res_0603)
R71  value 10K  [RES_0603]  (hidden comment: Res_0603)
R72  value 10K  [RES_0603]  (hidden comment: Res_0603)
R73  value 10K  [RES_0603]  (hidden comment: Res_0603)
R75  value 1.5K  [RES_0603]  (hidden comment: Res_0603)
R76  value 1.5K  [RES_0603]  (hidden comment: Res_0603)
R77  value 150  [RES_0603]  (hidden comment: Res_0603)
R78  value 150  [RES_0603]  (hidden comment: Res_0603)
R79  value 150  [RES_0603]  (hidden comment: Res_0603)
R82  value 510  [RES_0603]  (hidden comment: Res_0603)
R83  value 510  [RES_0603]  (hidden comment: Res_0603)
R86  value 640K  [RES_0603]  (hidden comment: Res_0603)
R92  value 510  [RES_0603]  (hidden comment: Res_0603)
R93  value 510  [RES_0603]  (hidden comment: Res_0603)
R94  value 510  [RES_0603]  (hidden comment: Res_0603)
R95  value 510  [RES_0603]  (hidden comment: Res_0603)
R96  value 510  [RES_0603]  (hidden comment: Res_0603)
R97  value 510  [RES_0603]  (hidden comment: Res_0603)
R98  value 510  [RES_0603]  (hidden comment: Res_0603)
R99  value 510  [RES_0603]  (hidden comment: Res_0603)
R100  value 510  [RES_0603]  (hidden comment: Res_0603)
R101  value 510  [RES_0603]  (hidden comment: Res_0603)
R102  value 510  [RES_0603]  (hidden comment: Res_0603)
R103  value 510  [RES_0603]  (hidden comment: Res_0603)
R104  value 510  [RES_0603]  (hidden comment: Res_0603)
R105  value 510  [RES_0603]  (hidden comment: Res_0603)
R106  value 510  [RES_0603]  (hidden comment: Res_0603)
R107  value 510  [RES_0603]  (hidden comment: Res_0603)
R108  value 510  [RES_0603]  (hidden comment: Res_0603)
R109  value 510  [RES_0603]  (hidden comment: Res_0603)
R110  value 510  [RES_0603]  (hidden comment: Res_0603)
R111  value 510  [RES_0603]  (hidden comment: Res_0603)
R112  value 510  [RES_0603]  (hidden comment: Res_0603)
R113  value 510  [RES_0603]  (hidden comment: Res_0603)
R114  value 510  [RES_0603]  (hidden comment: Res_0603)
R115  value 510  [RES_0603]  (hidden comment: Res_0603)
R116  value 510  [RES_0603]  (hidden comment: Res_0603)
R117  value 510  [RES_0603]  (hidden comment: Res_0603)
R118  value 510  [RES_0603]  (hidden comment: Res_0603)
RX_P18  HDR1x2_2.54  [HDR1X2_2.54_180F]  (value not drawn)
S1  ButtonTACT_3x6x2.5_180  [ButtonTACT_3x6x2.5_180]  (value not drawn)
S2  ButtonTACT_3x6x2.5_180  [ButtonTACT_3x6x2.5_180]  (value not drawn)
U1  EP4CE6E22I7  [EQFP144_N]  (parts A,B,C,D,E,F,G,H,I,J,K,L,M of 13)
Y1  HC49US-16MHZ-32P  [H25]

### Nets
+1.2V_D: C91.2 C92.2 C93.2 C94.2 C95.2 C96.2 C97.2 C98.2 C101.2 C102.2 U1.5(VCCINT) U1.29(VCCINT) U1.37(VCCD_PLL1) U1.45(VCCINT) U1.61(VCCINT) U1.78(VCCINT) U1.102(VCCINT) U1.109(VCCD_PLL2) U1.116(VCCINT) U1.134(VCCINT)
+2.5V_D: C99.2 C100.2 U1.35(VCCA1) U1.107(VCCA2)
+3.3V: P25.3 P25.5 P25.7
+3.3V_D: C50.2 C51.2 C52.2 C53.2 C54.2 C55.2 C56.2 C57.2 C83.2 C84.2 C85.2 C86.2 C87.2 C88.2 C89.2 C90.2 IC2.3(Vcc) IC2.7(Vcc) IC2.8(Vcc) IC9.8(VCC) P13.1 P26.4 R63.1 R64.1 R65.1 R69.1 R70.1 R71.1 R72.1 R75.2 R76.2 U1.17(VCCIO1) U1.26(VCCIO2) U1.40(VCCIO3) U1.47(VCCIO3) U1.56(VCCIO4) U1.62(VCCIO4) U1.81(VCCIO5) U1.93(VCCIO6) U1.94(MSEL0) U1.97(MSEL2) U1.117(VCCIO7) U1.122(VCCIO7) U1.130(VCCIO8) U1.139(VCCIO8)
+3.3V_REF: IC13.5(OUT_S) IC13.6(OUT_F) P20.1 P25.1
+5V: P20.3 P23.1 P23.3 P24.1 P24.3 P25.9
+5V_IM: C72.2 IC13.4(IN) R86.2
GND: C50.1 C51.1 C52.1 C53.1 C54.1 C55.1 C56.1 C57.1 C72.1 C77.1 C83.1 C84.1 C85.1 C86.1 C87.1 C88.1 C89.1 C90.1 C91.1 C92.1 C93.1 C94.1 C95.1 C96.1 C97.1 C98.1 C99.1 C100.1 C101.1 C102.1 C103.1 C104.1 C105.1 IC2.4(GND) IC9.4(GND) IC13.1(GND_F) IC13.2(GND_S) J1.6 J1.10 P19.3 P19.4 P20.2 P20.4 P20.5 P20.7 P21.3 P21.4 P21.35 P21.36 P21.61 P21.62 P21.96 P22.4 P22.6 P22.8 P22.9 P22.11 P22.13 P23.2 P23.4 P24.2 P24.4 P25.2 P25.4 P25.6 P25.8 P25.10 P26.2 P26.6 P27.3 P27.4 R73.2 RX_P18.1 S1.1 S2.1 U1.4(GND) U1.19(GND) U1.22(GND) U1.27(GND) U1.36(GNDA1) U1.41(GND) U1.48(GND) U1.57(GND) U1.63(GND) U1.79(GND) U1.82(GND) U1.95(GND) U1.96(MSEL1) U1.108(GNDA2) U1.118(GND) U1.123(GND) U1.131(GND) U1.140(GND)
ASDO: IC2.5(ASDI) U1.6(IO,_DIFFIO_L1n,_(DATA1,ASDO))
CLK: IC9.5(Y) U1.23(CLK1,_DIFFCLK_0n)
CONFIG_N: R70.2 S2.2 U1.14(nCONFIG)
CSO_N: IC2.1(*CS) U1.8(IO,_DIFFIO_L2p,_(FLASH_nCE,nCSO))
DATAO: IC2.2(DATA) U1.13(IO,_(DATA0))
DCLK: IC2.6(DCLK) U1.12(DCLK)
I_CMD_0: R93.1 U1.85(IO,_DIFFIO_R8p,_(DQS1R/CQ1R#,DPCLK4))
I_CMD_1: R94.1 U1.84(IO,_DIFFIO_R8n)
I_CMD_2: R96.1 U1.76(IO,_RUP3)
I_CMD_3: R98.1 U1.74(IO)
I_DATA_0: R110.2 U1.52(IO,_DIFFIO_B11p)
I_DATA_1: R108.2 U1.58(IO,_DIFFIO_B15p,_(DQ1B))
I_DATA_2: R112.2 U1.50(IO,_DIFFIO_B9n,_(DQ1B))
I_DATA_3: R106.2 U1.64(IO)
I_DATA_4: R102.2 U1.68(IO,_DIFFIO_B20n,_(DQS0B/CQ1B,DPCLK3))
I_DATA_5: R101.2 U1.69(IO)
I_DATA_6: R104.2 U1.66(IO,_RUP2,_(DQ1B))
I_DATA_7: R103.2 U1.67(IO,_RDN2,_(DQ1B))
I_RST_N: R117.2 U1.71(IO,_DIFFIO_B21n)
I_SYNC: R95.2 U1.77(IO,_RDN3)
IO_CUST: R118.2 U1.70(IO,_DIFFIO_B21p)
M_TX_EN2_N: P22.14 U1.132(IO,_DIFFIO_T10n,_(DATA2),_(DQ1T))
M_TX_EN2_P: P22.3 U1.133(IO,_DIFFIO_T10p,_(DATA3),_(DQ1T))
M_TX_EN3_N: P22.15 U1.128(IO,_DIFFIO_T11n)
M_TX_EN3_P: P22.2 U1.129(IO,_DIFFIO_T11p)
M_TX_EN4_N: P22.16 U1.126(IO,_DIFFIO_T12n)
M_TX_EN4_P: P22.1 U1.127(IO,_DIFFIO_T12p)
M_TX_ENABLE: P22.12 U1.138(IO,_(DATA6))
M_TX_OSC_EN_N: P22.10 U1.143(IO,_DIFFIO_T1n,_(DQ1T))
M_TX_OSC_EN_P: P22.7 U1.144(IO,_DIFFIO_T1p,_(DM1T))
M_TX_SELB: P22.5 U1.141(IO,_DIFFIO_T5p)
O_DATA_0: R105.1 U1.65(IO,_VREFB4N0)
O_DATA_1: R107.1 U1.59(IO,_DIFFIO_B16p,_(DQ1B))
O_DATA_2: R109.1 U1.53(IO,_DIFFIO_B11n)
O_DATA_3: R111.1 U1.51(IO,_DIFFIO_B10p,_(DQ1B))
O_DATA_4: R113.1 U1.49(IO,_DIFFIO_B9p,_(DQ1B))
O_DATA_5: R114.1 U1.43(IO,_PLL1_CLKOUTp)
O_DATA_6: R115.1 U1.42(IO,_(DQS1B/CQ1B#,DPCLK2))
O_DATA_7: R116.1 U1.38(IO,_DIFFIO_B1p)
O_RX_INT: R99.2 U1.73(IO)
O_SYNC: R97.2 U1.75(IO)
O_TX_INT: R100.2 U1.72(IO,_DIFFIO_B22p)
REC_CLK_N: R83.1 U1.90(CLK5,_DIFFCLK_2n)
REC_CLK_P: R92.1 U1.91(CLK4,_DIFFCLK_2p)
RESET: C105.2 R69.2 S1.2 U1.125(IO)
RX_A0: P26.1 R79.1
RX_INTEGR: R82.1 RX_P18.2
RX_N: P27.2 U1.101(IO,_DIFFIO_R3n,_(nCEO))
RX_P: P27.1 U1.103(IO,_DIFFIO_R3p,_(CLKUSR))
RX_SCL: P26.3 R75.1 R78.1
RX_SDA: P26.5 R76.1 R77.1
TCK: J1.1 U1.16(TCK)
TDI: J1.5 R72.2 U1.15(TDI)
TDO: J1.2 U1.20(TDO)
TMS: J1.3 R71.2 U1.18(TMS)
NetC77_2: C77.2 IC13.3(ENABLE) R86.1
NetC103_2: C103.2 R67.2 Y1.1
NetC104_2: C104.2 IC9.3(XIN) R66.1 Y1.2
NetIC9_1: IC9.1(CTRL) R65.2
NetIC9_2: IC9.2(XOUT) R66.2 R67.1
NetIC9_6: IC9.6(A) IC9.7(OSCOUT)
NetJ1_9: J1.9 P13.2
NetP19_1: P19.1 P19.2 P20.8
NetP20_6: P20.6 P21.2 P21.97
NetP21_5: P21.5 R82.2
NetP21_9: P21.9 R93.2
NetP21_11: P21.11 R94.2
NetP21_13: P21.13 R96.2
NetP21_14: P21.14 R95.1
NetP21_15: P21.15 R98.2
NetP21_16: P21.16 R97.1
NetP21_18: P21.18 R99.1
NetP21_20: P21.20 R100.1
NetP21_22: P21.22 R117.1
NetP21_24: P21.24 R118.1
NetP21_38: P21.38 R101.1
NetP21_40: P21.40 R102.1
NetP21_42: P21.42 R103.1
NetP21_43: P21.43 R105.2
NetP21_44: P21.44 R104.1
NetP21_45: P21.45 R107.2
NetP21_46: P21.46 R106.1
NetP21_47: P21.47 R109.2
NetP21_48: P21.48 R108.1
NetP21_49: P21.49 R111.2
NetP21_50: P21.50 R110.1
NetP21_51: P21.51 R113.2
NetP21_52: P21.52 R112.1
NetP21_53: P21.53 R114.2
NetP21_55: P21.55 R115.2
NetP21_57: P21.57 R116.2
NetP21_81: P21.81 R77.2
NetP21_83: P21.83 R78.2
NetP21_85: P21.85 R79.2
NetR63_2: R63.2 U1.9(nSTATUS)
NetR64_2: R64.2 U1.92(CONF_DONE)
NetR73_1: R73.1 U1.21(nCE)
NetR83_2: R83.2 U1.86(IO,_DIFFIO_R7n,_(DEV_OE))
NetR92_2: R92.2 U1.87(IO,_DIFFIO_R7p,_(DEV_CLRn))

Not connected (* = marked no-connect by the designer): J1 4 7 8; P13 3; P21 1 6 7 8 10 12 17 19 21 23 25 26 27 28 29 30 31 32 33 34 37 39 41 54 56 58 59 60 63 64 65 66 67 68 69 70 71 72 73 74 75 76 77 78 79 80 82 84 86 87 88 89 90 91 92 93 94 95 98; U1 1(IO) 2(IO) 3(IO) 7(IO,_VREFB1N0) 10(IO,_DIFFIO_L4p,_(DQS0L/CQ1L,DPCLK0)) 11(IO,_DIFFIO_L4n) 24(CLK2,_DIFFCLK_1p)* 25(CLK3,_DIFFCLK_1n)* 28(IO,_DIFFIO_L6n) 30(IO,_DIFFIO_L8p,_(DQS1L/CQ1L#,DPCLK1)) 31(IO,_VREFB2N0) 32(IO,_RUP1) 33(IO,_RDN1) 34(IO) 39(IO,_DIFFIO_B1n) 44(IO,_PLL1_CLKOUTn) 46(IO,_VREFB3N0) 54(IO,_DIFFIO_B12p) 55(IO,_DIFFIO_B12n) 60(IO,_DIFFIO_B16n,_(DQ1B)) 80(IO,_VREFB5N0) 83(IO) 88(CLK7,_DIFFCLK_3n)* 89(CLK6,_DIFFCLK_3p)* 98(IO,_DIFFIO_R4n,_(INIT_DONE)) 99(IO,_DIFFIO_R4p,_(CRC_ERROR)) 100(IO) 104(IO,_(DQS0R/CQ1R,DPCLK5)) 105(IO,_VREFB6N0) 106(IO,_DIFFIO_R1n) 110(IO,_DIFFIO_T20p,_(DQS0T/CQ1T,DPCLK6)) 111(IO,_DIFFIO_T19p) 112(IO,_PLL2_CLKOUTn) 113(IO,_PLL2_CLKOUTp) 114(IO,_RUP4,_(DQ1T)) 115(IO,_RDN4,_(DQ1T)) 119(IO,_VREFB7N0) 120(IO,_DIFFIO_T16n,_(DQ1T)) 121(IO,_DIFFIO_T16p) 124(IO,_DIFFIO_T13p) 135(IO,_DIFFIO_T8n,_(DQ1T)) 136(IO,_VREFB8N0) 137(IO,_(DATA5),_(DQ1T)) 142(IO,_DIFFIO_T2p,_(DQS1T/CQ1T#,DPCLK7))

### Layout directives
differential pair; net class DIFF100: M_TX_EN2_N, M_TX_EN2_P, M_TX_EN3_N, M_TX_EN3_P, M_TX_EN4_N, M_TX_EN4_P, M_TX_OSC_EN_N, M_TX_OSC_EN_P
differential pair; net class RXDIFF100: RX_N, RX_P

### Notes on the sheet
- (near J1) NC
- Transmitter interface
- (near P19) TP13
- Receiver interface
- PB_4(A10)
- PH_0
- PH_1
- PH_2
- PH_3
- PN4
- PN5
- PN0
- (in symbol EP4CE6E22I7, part A) BANK 1
- (in symbol EP4CE6E22I7, part B) BANK 2
- (in symbol EP4CE6E22I7, part C) BANK 3
- (in symbol EP4CE6E22I7, part D) BANK 4
- (in symbol EP4CE6E22I7, part E) BANK 5
- (in symbol EP4CE6E22I7, part F) BANK 6
- (in symbol EP4CE6E22I7, part G) BANK 7
- (in symbol EP4CE6E22I7, part H) BANK 8

### Library data of the parts
C50-C57 C72 C77 C83-C105 = Cap_0603: Capacitor
IC2 = EPCS16SI8N: Imported; Voltage - Supply: 3 V ~ 3.6 V; Memory Size: 16Mb; Programmable Type: In System Programmable; Vendor: Altera; C: Copyright (C) 2015 Accelerated Designs. All rights reserved; NewarkPartNumber: 80P4116; Operating Temperature: -40В°C ~ 85В°C; Packaging: Tube; Package / Case: 8-SOIC (0.154", 3.90mm Width); DigiKeyPartNumber: 544-2567-5-ND; Manufacturer_Part_Number: EPCS16SI8N; Quantity_Available: 6694; DataSheet: http://www.altera.com/literature/hb/cfg/cyc_c51014.pdf; Supplier Device Package: 8-SOIC; Copyright: Copyright (C) 2015 Accelerated Designs. All rights reserved; RefDes: RefDes; Type: DEV; Value: Value
IC9 = SN74LVC1404DCUR: Imported; Vendor: Texas Instruments; PACKAGE_DESIGNATOR: DCU; PIN_COUNT: 8; FAMILY_NAME: INVERTING BUFFER/DRIVER; INDUSTRY_STD_PKG_TYPE: US8; 3D_Library_Name: TI_AllParts_2012-12-25; C: Copyright (C) 2015 Accelerated Designs. All rights reserved; Manufacturer_Part_Number: SN74LVC1404DCUR; GENERIC_PART_NUMBER: SN74LVC1404; Datasheet URL: http://www.ti.com/lit/gpn/SN74LVC1404; Manufacturer: Texas Instruments; Copyright: Copyright (C) 2015 Accelerated Designs. All rights reserved; RefDes: RefDes; Type: DEV; Value: Value
IC13 = REF3233AIDBVT: Imported; Manufacturer: Texas Instruments; Manufacturer_Part_Number: ref3233_dbv_6; INDUSTRY_STD_PKG_TYPE: SOT-23; FAMILY_NAME: SERIES VOLTAGE REFERENCE; PIN_COUNT: 6; PACKAGE_DESIGNATOR: DBV; C: Copyright (C) 2015 Accelerated Designs. All rights reserved; Datasheet URL: http://www.ti.com/lit/gpn/REF3233; GENERIC_PART_NUMBER: REF3233; Vendor: Texas Instruments; Copyright: Copyright (C) 2015 Accelerated Designs. All rights reserved; RefDes: RefDes; Type: DEV; Value: Value
J1 = WR-WTB, 66101021622: WR-WTB 2.54mm Shrouded Header_Straight; Manufacturer: Wurth Elektronik; ComponentLink1 Description: Manufacturer; ComponentLink2 Description: Datasheet; NoPins: 10; Created Date: 9.Oct.2015; partNo: 66101021622; ComponentLink1URL: http://www.we-online.com; ComponentLink2URL: http://katalog.we-online.de/em/datasheet/6610XX11622.pdf; Created by: Baojun Chen
P13 = WE-2.54 mm Pin Header & Jumper 61300311121: WR-PHD 2.54mm Pin Header; Manufacturer: WЁ№rth Elektronik eiSos GmbH; ComponentLink1 Description: Manufacturer; ComponentLink2 Description: Datasheet; NoPins: 03; Created Date: 22 March 2013; partNo: 61300311121; ComponentLink1URL: http://www.we-online.com; ComponentLink2URL: http://katalog.we-online.de/em/datasheet/6130xx11121.pdf; Created by: Karrer Zheng
P19 = WE-2.54 mm Pin Header & Jumper 61000418221: as P1 on sheet PhotodiodeReceiverV1; Created Date: 26 March 2013; partNo: 61000418221; ComponentLink1URL: http://www.we-online.com; ComponentLink2URL: http://katalog.we-online.de/em/datasheet/6100xx18221.pdf; Created by: Karrer Zheng
P20 = WE-2.54 mm Pin Header & Jumper 610x0821121: WR-PHD 2.54 mm Dual SMT Pin Header; Manufacturer: WЁ№rth Elektronik eiSos GmbH; ComponentLink1 Description: Manufacturer; ComponentLink2 Description: Datasheet; NoPins: 08; Created Date: 22 March 2013; partNo: 610x0821121; ComponentLink1URL: http://www.we-online.com; ComponentLink2URL: http://katalog.we-online.de/em/datasheet/6100xx21121.pdf; Created by: Karrer Zheng
P21 = Breadboard connection 2.54mm: NoPins: 98; Created Date: 3 July 2016; Created by: Maksym Hilliaka
P22 = WE-2.54 mm Socket Header 61001621821: WR-PHD 2.54 mm Dual SMT Socket Header; Manufacturer: WЁ№rth Elektronik eiSos GmbH; ComponentLink1 Description: Manufacturer; ComponentLink2 Description: Datasheet; NoPins: 16; Created Date: 29 March 2013; partNo: 61001621821; ComponentLink1URL: http://www.we-online.com; ComponentLink2URL: http://katalog.we-online.de/em/datasheet/6100xx21821.pdf; Created by: Karrer Zheng
P23 P24 = WE-2.54 mm Socket Header 61000411921: WR-PHD 2.54 mm SMT Socket Header; Manufacturer: WЁ№rth Elektronik eiSos GmbH; ComponentLink1 Description: Manufacturer; ComponentLink2 Description: Datasheet; NoPins: 4; Created Date: 29 March 2013; partNo: 61000411921; ComponentLink1URL: http://www.we-online.com; ComponentLink2URL: http://katalog.we-online.de/em/datasheet/6100xx11921.pdf; Created by: Karrer Zheng
P25 = WE-2.54 mm Socket Header 61301011821: WR-PHD 2.54 mm Socket Header; Manufacturer: WЁ№rth Elektronik eiSos GmbH; ComponentLink1 Description: Manufacturer; ComponentLink2 Description: Datasheet; NoPins: 10; Created Date: 29 March 2013; partNo: 61301011821; ComponentLink1URL: http://www.we-online.com; ComponentLink2URL: http://katalog.we-online.de/em/datasheet/6130xx11821.pdf; Created by: Karrer Zheng
P26 = WE-2.54 mm Socket Header 61000613321: WR-PHD 2.54 mm SMT Socket Header; Manufacturer: WЁ№rth Elektronik eiSos GmbH; ComponentLink1 Description: Manufacturer; ComponentLink2 Description: Datasheet; NoPins: 6; Created Date: 29 March 2013; partNo: 61000613321; ComponentLink1URL: http://www.we-online.com; ComponentLink2URL: http://katalog.we-online.de/em/datasheet/6100xx11921.pdf; Created by: Karrer Zheng
P27 = WE-2.54 mm Socket Header 61000413321: WR-PHD 2.54 mm SMT Socket Header; Manufacturer: WЁ№rth Elektronik eiSos GmbH; ComponentLink1 Description: Manufacturer; ComponentLink2 Description: Datasheet; NoPins: 4; Created Date: 29 March 2013; partNo: 61000413321; ComponentLink1URL: http://www.we-online.com; ComponentLink2URL: http://katalog.we-online.de/em/datasheet/6100xx11921.pdf; Created by: Karrer Zheng
R63-R67 R69-R73 R75-R79 R82 R83 R86 R92-R118 = Res_0603: Resistor
RX_P18 = HDR1x2_2.54T: Header
S1 S2 = ButtonTACT_3x6x2.5_180: Button
U1 = EP4CE6E22I7: Cyclone IV Family FPGA, 2V Core, 91 I/O Pins, 2 PLLs, 144-Pin QFP, Speed Grade 7, Industrial Grade; Published: 3-May-2010; DatasheetVersion: ver1.2, Mar-2010; PackageVersion: ver16.0, Dec-2009; PackageReference: EQFP144; Publisher: Altium Limited; PackageDescription: 144-Pin Plastic Enhanced Quad Flat Pack (EQFP144) - Wire Bond; Supplier 1: Digi-Key; Supplier Part Number 1: EP4CE6E22I7-ND; Code_JEDEC: MS-026-BFB; ComponentLink1Description: Manufacturer Link; ComponentLink1URL: http://www.altera.com/; ComponentLink2Description: Handbook; ComponentLink2URL: http://www.altera.com/literature/hb/cyclone-iv/cyclone4-handbook.pdf; ComponentLink3Description: Pinout Specification; ComponentLink3URL: http://www.altera.com/literature/lit-dp.jsp?category=cyc%204&showspreadsheet=y; ComponentLink4Description: Packaging Specification; ComponentLink4URL: http://www.altera.com/literature/ds/dspkg.pdf
Y1 = HC49US-25MHZ-32P: Imported; Manufacturer_Part_Number: HC49/US-25MHz-32pF-3OT-30-EXT-SMD-H25-TR; Vendor: Rami Technology; C: Copyright (C) 2015 Accelerated Designs. All rights reserved; Copyright: Copyright (C) 2015 Accelerated Designs. All rights reserved; RefDes: RefDes; Type: DEV; Value: Value

## Sheet LVDSDriverReceiver.SchDoc
size B
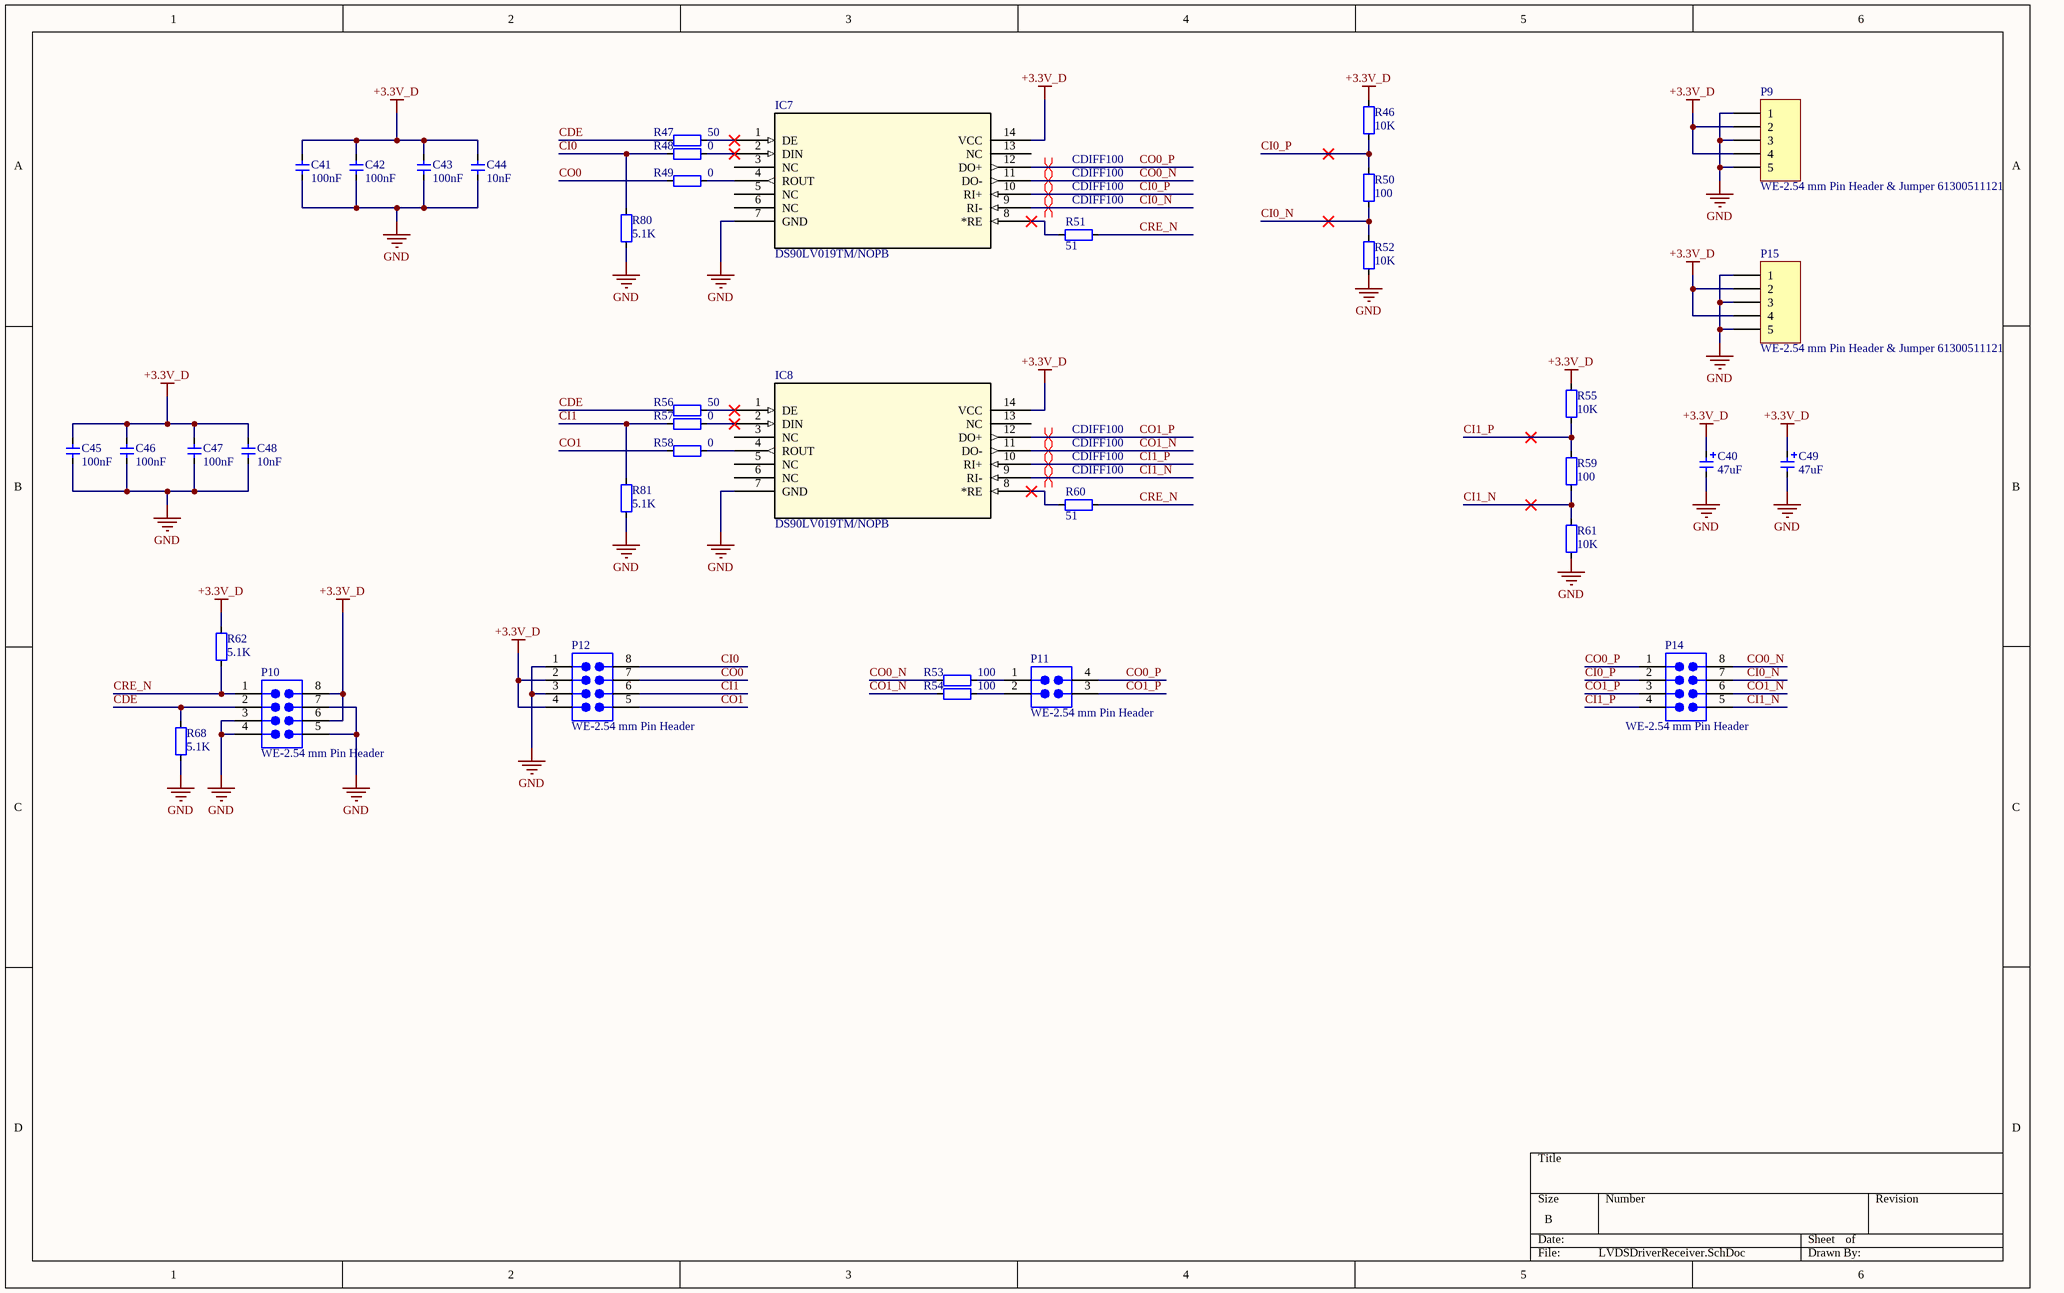
[diagram p7: LVDSDriverReceiver.SchDoc]

### Parts
C40  value 47uF  [CAP_TAN_B1210]  (hidden comment: Cap_Tan_1210)
C41  value 100nF  [CAP_0603]  (hidden comment: Cap_0603)
C42  value 100nF  [CAP_0603]  (hidden comment: Cap_0603)
C43  value 100nF  [CAP_0603]  (hidden comment: Cap_0603)
C44  value 10nF  [CAP_0603]  (hidden comment: Cap_0603)
C45  value 100nF  [CAP_0603]  (hidden comment: Cap_0603)
C46  value 100nF  [CAP_0603]  (hidden comment: Cap_0603)
C47  value 100nF  [CAP_0603]  (hidden comment: Cap_0603)
C48  value 10nF  [CAP_0603]  (hidden comment: Cap_0603)
C49  value 47uF  [CAP_TAN_B1210]  (hidden comment: Cap_Tan_1210)
IC7  DS90LV019TM/NOPB  [M14A]
IC8  DS90LV019TM/NOPB  [M14A]
P9  WE-2.54 mm Pin Header & Jumper 61300511121  [61300511121]
P10  WE-2.54 mm Pin Header  [610x0821121]
P11  WE-2.54 mm Pin Header  [610x0421121]
P12  WE-2.54 mm Pin Header  [610x0821121]
P14  WE-2.54 mm Pin Header  [610x0821121]
P15  WE-2.54 mm Pin Header & Jumper 61300511121  [61300511121]
R46  value 10K  [RES_0603]  (hidden comment: Res_0603)
R47  value 50  [RES_0603]  (hidden comment: Res_0603)
R48  value 0  [RES_0603]  (hidden comment: Res_0603)
R49  value 0  [RES_0603]  (hidden comment: Res_0603)
R50  value 100  [RES_0603]  (hidden comment: Res_0603)
R51  value 51  [RES_0603]  (hidden comment: Res_0603)
R52  value 10K  [RES_0603]  (hidden comment: Res_0603)
R53  value 100  [RES_0603]  (hidden comment: Res_0603)
R54  value 100  [RES_0603]  (hidden comment: Res_0603)
R55  value 10K  [RES_0603]  (hidden comment: Res_0603)
R56  value 50  [RES_0603]  (hidden comment: Res_0603)
R57  value 0  [RES_0603]  (hidden comment: Res_0603)
R58  value 0  [RES_0603]  (hidden comment: Res_0603)
R59  value 100  [RES_0603]  (hidden comment: Res_0603)
R60  value 51  [RES_0603]  (hidden comment: Res_0603)
R61  value 10K  [RES_0603]  (hidden comment: Res_0603)
R62  value 5.1K  [RES_0603]  (hidden comment: Res_0603)
R68  value 5.1K  [RES_0603]  (hidden comment: Res_0603)
R80  value 5.1K  [RES_0603]  (hidden comment: Res_0603)
R81  value 5.1K  [RES_0603]  (hidden comment: Res_0603)

### Nets
+3.3V_D: C40.1 C41.2 C42.2 C43.2 C44.2 C45.2 C46.2 C47.2 C48.2 C49.1 IC7.14(VCC) IC8.14(VCC) P9.2 P9.4 P10.6 P10.8 P12.2 P12.4 P15.2 P15.4 R46.2 R55.2 R62.1
GND: C40.2 C41.1 C42.1 C43.1 C44.1 C45.1 C46.1 C47.1 C48.1 C49.2 IC7.7(GND) IC8.7(GND) P9.1 P9.3 P9.5 P10.3 P10.4 P10.5 P10.7 P12.1 P12.3 P15.1 P15.3 P15.5 R52.1 R61.1 R68.2 R80.2 R81.2
CDE: P10.2 R47.2 R56.2 R68.1
CI0: P12.8 R48.2 R80.1
CI0_N: IC7.9(RI-) P14.7 R50.1 R52.2
CI0_P: IC7.10(RI+) P14.2 R46.1 R50.2
CI1: P12.6 R57.2 R81.1
CI1_N: IC8.9(RI-) P14.5 R59.1 R61.2
CI1_P: IC8.10(RI+) P14.4 R55.1 R59.2
CO0: P12.7 R49.2
CO0_N: IC7.11(DO-) P14.8 R53.2
CO0_P: IC7.12(DO+) P11.4 P14.1
CO1: P12.5 R58.2
CO1_N: IC8.11(DO-) P14.6 R54.2
CO1_P: IC8.12(DO+) P11.3 P14.3
CRE_N: P10.1 R51.1 R60.1 R62.2
NetIC7_1: IC7.1(DE) R47.1
NetIC7_2: IC7.2(DIN) R48.1
NetIC7_4: IC7.4(ROUT) R49.1
NetIC7_8: IC7.8(*RE) R51.2
NetIC8_1: IC8.1(DE) R56.1
NetIC8_2: IC8.2(DIN) R57.1
NetIC8_4: IC8.4(ROUT) R58.1
NetIC8_8: IC8.8(*RE) R60.2
NetP11_1: P11.1 R53.1
NetP11_2: P11.2 R54.1

Not connected (* = marked no-connect by the designer): IC7 3(NC) 5(NC) 6(NC) 13(NC); IC8 3(NC) 5(NC) 6(NC) 13(NC)

### Layout directives
differential pair; net class CDIFF100: CI0_N, CI0_P, CI1_N, CI1_P, CO0_N, CO0_P, CO1_N, CO1_P

### Library data of the parts
C40 C49 = Cap_Tan_1210: Capacitor
C41-C48 = Cap_0603: Capacitor
IC7 IC8 = DS90LV019TM/NOPB: Imported; Manufacturer_Part_Number: ds90lv019tmnopb; Vendor: National Semiconductor; C: Copyright (C) 2015 Accelerated Designs. All rights reserved; Copyright: Copyright (C) 2015 Accelerated Designs. All rights reserved; RefDes: RefDes; Type: DEV; Value: Value
P9 P15 = WE-2.54 mm Pin Header & Jumper 61300511121: WR-PHD 2.54mm Pin Header; Manufacturer: WЁ№rth Elektronik eiSos GmbH; ComponentLink1 Description: Manufacturer; ComponentLink2 Description: Datasheet; NoPins: 05; Created Date: 22 March 2013; partNo: 61300511121; ComponentLink1URL: http://www.we-online.com; ComponentLink2URL: http://katalog.we-online.de/em/datasheet/6130xx11121.pdf; Created by: Karrer Zheng
P10 P12 P14 = WE-2.54 mm Pin Header & Jumper 610x0821121: as P20 on sheet Main; Created Date: 22 March 2013; partNo: 610x0821121; ComponentLink1URL: http://www.we-online.com; ComponentLink2URL: http://katalog.we-online.de/em/datasheet/6100xx21121.pdf; Created by: Karrer Zheng
P11 = WE-2.54 mm Pin Header & Jumper 610x0421121: WR-PHD 2.54 mm Dual SMT Pin Header; Manufacturer: WЁ№rth Elektronik eiSos GmbH; ComponentLink1 Description: Manufacturer; ComponentLink2 Description: Datasheet; NoPins: 04; Created Date: 22 March 2013; partNo: 610x0421121; ComponentLink1URL: http://www.we-online.com; ComponentLink2URL: http://katalog.we-online.de/em/datasheet/6100xx21121.pdf; Created by: Karrer Zheng
R46-R62 R68 R80 R81 = Res_0603: Resistor

## Nets that join several sheets
+1.2V_D: PowerSupply (C106.1 C107.2 IC10.2), Main (20 pins)
+2.5V_D: PowerSupply (C114.1 C115.2 IC16.2), Main (C99.2 C100.2 U1.35 U1.107)
+3.3V: PhotodiodeReceiverV1 (22 pins), PowerSupply (6 pins), Main (P25.3 P25.5 P25.7)
+3.3V_D: PhotodiodeReceiverV1 (P7.4 R35.2 R36.2), PowerSupply (5 pins), Main (45 pins), LVDSDriverReceiver (23 pins)
+3.3V_REF: PhotodiodeReceiverV1 (5 pins), Main (IC13.5 IC13.6 P20.1 P25.1)
+5V: TransmitterV1 (16 pins), PhotodiodeReceiverV1 (8 pins), PowerSupply (C66.1 C67.2 IC12.3), Main (6 pins)
+5V_IM: PowerSupply (8 pins), Main (C72.2 IC13.4 R86.2)
GND: TransmitterV1 (28 pins), PhotodiodeReceiverV1 (60 pins), PowerSupply (41 pins), Main (93 pins), LVDSDriverReceiver (29 pins)